# Altium project B101.PrjPcb
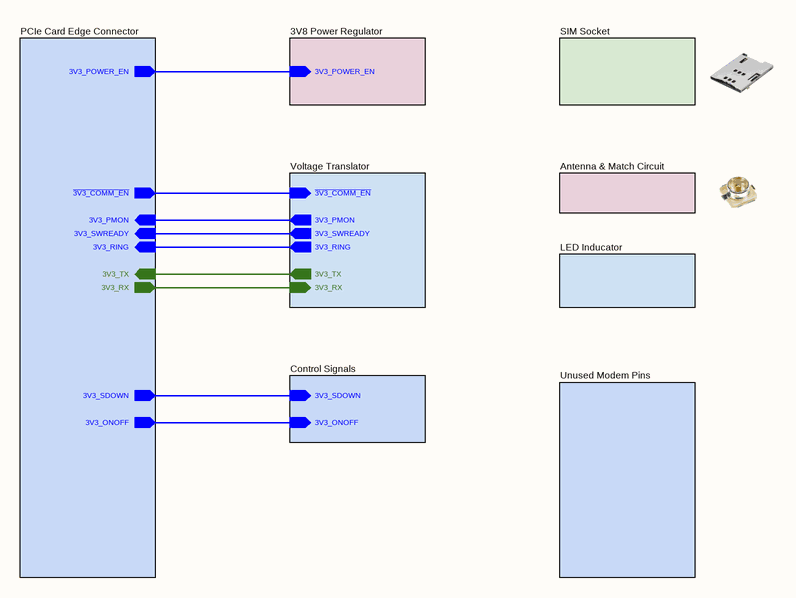
[diagram p0: GSM IoT Block Diagram.SchDoc]
Version_: 00.00.03; Revision_: CA; Product_ID_: B101; Product_Desc_: qSlot IoT 4G Modem; Organization_: Ovoo Electronics; Module_ID_: B101; Git_Repo_Address_: www.github.com/akkoyun/B101; Engineer_: Gunce Akkoyun; Customer_: Gunce Akkoyun; Copyright_: Copyright 2024 Mehmet Gunce Akkoyun (Commercial Secret); Address4_: Türkiye; Address3_: Selcuklu / Konya; Address2_: Silverstar Apt. 7/7; Address1_: Seker Mah. Ayyildiz Sok
9 sheets, 97 parts. Net scope: hierarchical (ports join the sheet entries above them; power ports are global).
Board file: B101.PcbDoc
Sheets:
  GSM IoT Block Diagram.SchDoc
    Voltage Translator = Voltage_Translator.SchDoc
    Antenna & Match Circuit = Antenna.SchDoc
    LED Inducator = Stat_LED_Driver.SchDoc
    SIM Socket = SIM_Socket.SchDoc
    3V8 Power Regulator = 3V8_Power_Regulator.SchDoc
    Unused Modem Pins = Unused_Modem_Pins.SchDoc
    PCIe Card Edge Connector = Edge_Connector.SchDoc
    Control Signals = Control_Signals.SchDoc

## Sheet GSM IoT Block Diagram.SchDoc: GSM IoT Block Diagram
size 292 x 193 mm; SheetNumber: 1; SheetTotal: 10

### Sub-sheets
3V8 Power Regulator = 3V8_Power_Regulator.SchDoc: 3V3_POWER_EN (in)
Antenna & Match Circuit = Antenna.SchDoc: no entries
Control Signals = Control_Signals.SchDoc: 3V3_SDOWN (in), 3V3_ONOFF (in)
LED Inducator = Stat_LED_Driver.SchDoc: no entries
PCIe Card Edge Connector = Edge_Connector.SchDoc: 3V3_POWER_EN (out), ~{3V3_COMM_EN} (out), 3V3_ONOFF (out), 3V3_SDOWN (out), 3V3_PMON (in), 3V3_SWREADY (in), 3V3_RING (in), 3V3_TX (in), 3V3_RX (out)
SIM Socket = SIM_Socket.SchDoc: no entries
Unused Modem Pins = Unused_Modem_Pins.SchDoc: no entries
Voltage Translator = Voltage_Translator.SchDoc: ~{3V3_COMM_EN} (in), 3V3_PMON (out), 3V3_SWREADY (out), 3V3_RING (out), 3V3_TX (out), 3V3_RX (in)

### Nets
~{3V3_COMM_EN}: sheet Voltage Translator/~{3V3_COMM_EN}, sheet PCIe Card Edge Connector/~{3V3_COMM_EN}
3V3_ONOFF: sheet PCIe Card Edge Connector/3V3_ONOFF, sheet Control Signals/3V3_ONOFF
3V3_PMON: sheet Voltage Translator/3V3_PMON, sheet PCIe Card Edge Connector/3V3_PMON
3V3_POWER_EN: sheet 3V8 Power Regulator/3V3_POWER_EN, sheet PCIe Card Edge Connector/3V3_POWER_EN
3V3_RING: sheet Voltage Translator/3V3_RING, sheet PCIe Card Edge Connector/3V3_RING
3V3_RX: sheet Voltage Translator/3V3_RX, sheet PCIe Card Edge Connector/3V3_RX
3V3_SDOWN: sheet PCIe Card Edge Connector/3V3_SDOWN, sheet Control Signals/3V3_SDOWN
3V3_SWREADY: sheet Voltage Translator/3V3_SWREADY, sheet PCIe Card Edge Connector/3V3_SWREADY
3V3_TX: sheet Voltage Translator/3V3_TX, sheet PCIe Card Edge Connector/3V3_TX

### Notes on the sheet
- © 2026 All rights reserved.
  This document may not, in whole or in part, be copied, photocopied, reproduced, translated or converted to any electronic or machine readable from without prior written permission of Mehmet Günce Akkoyun.
  Engineer contact : akkoyun@me.com
- Property of
- Engineer :
- Date :
- Size :
- A4
- Time :
- Project :
- Page :
- /
- Customer :
- Product ID :
- Module ID :
- Version :
- File :
- Revision :

## Sheet Voltage_Translator.SchDoc: Voltage Translator
size 420 x 297 mm; SheetNumber: 4; SheetTotal: 9
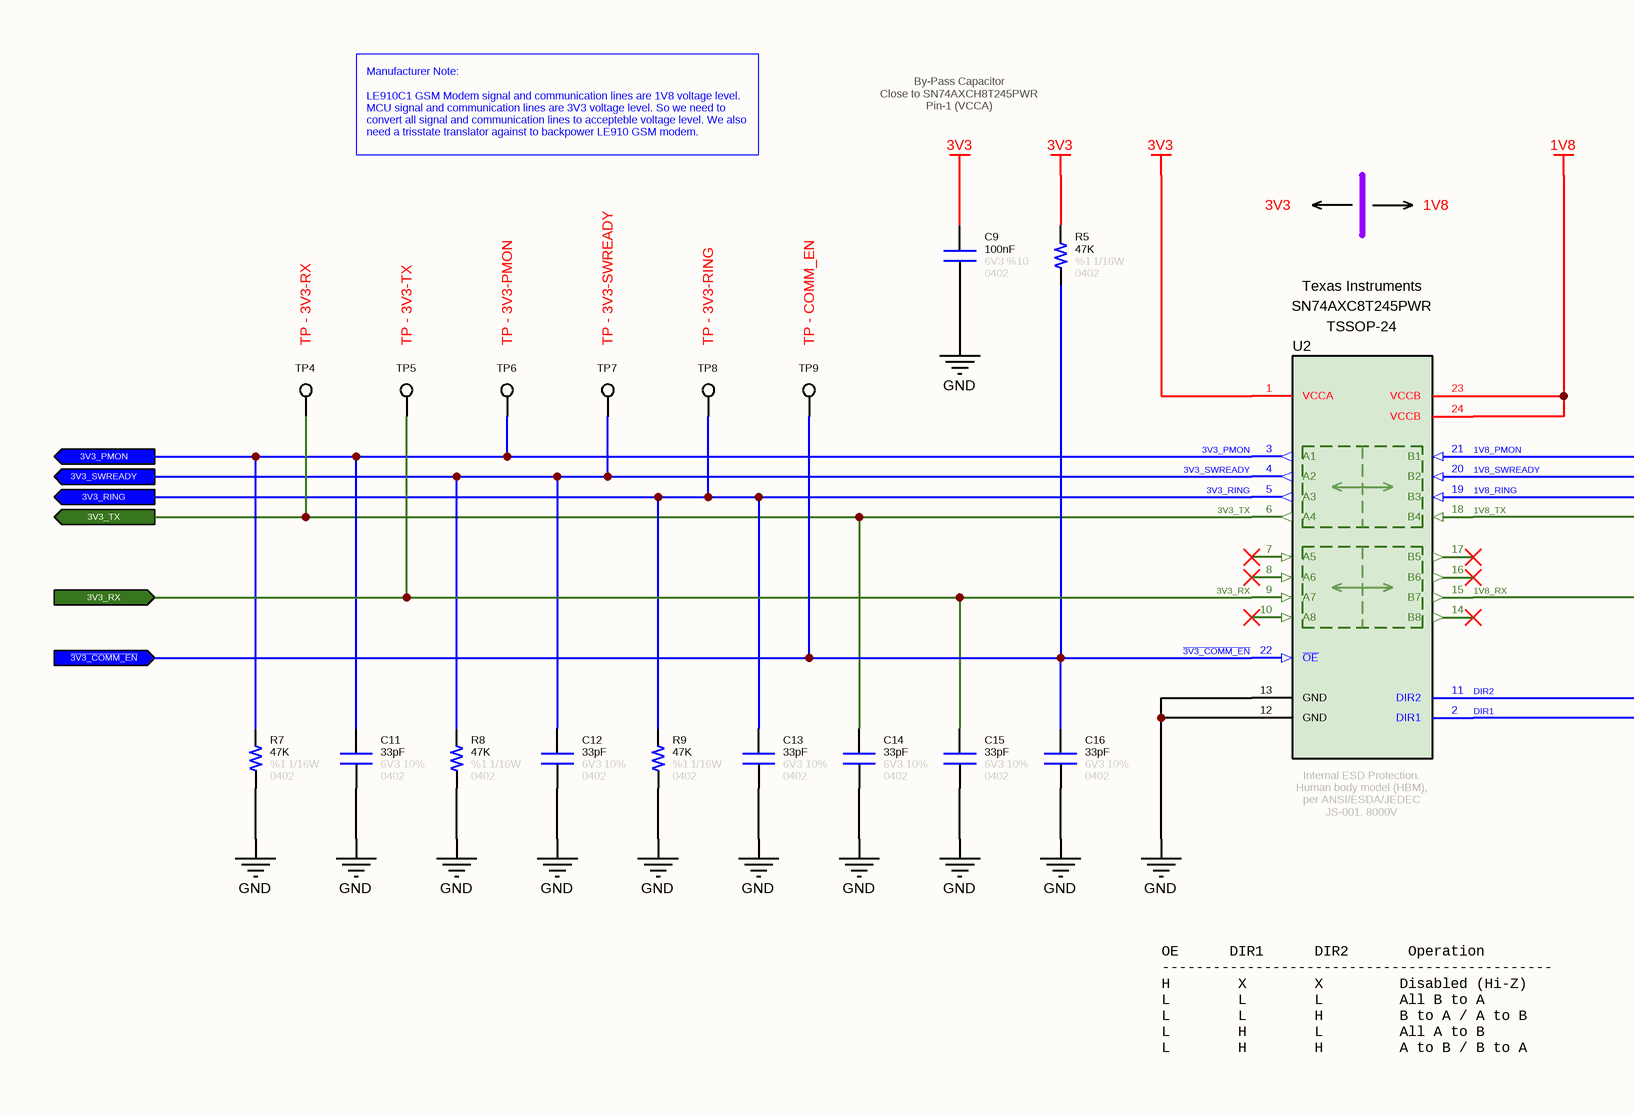
[diagram p1: Voltage_Translator.SchDoc, left]
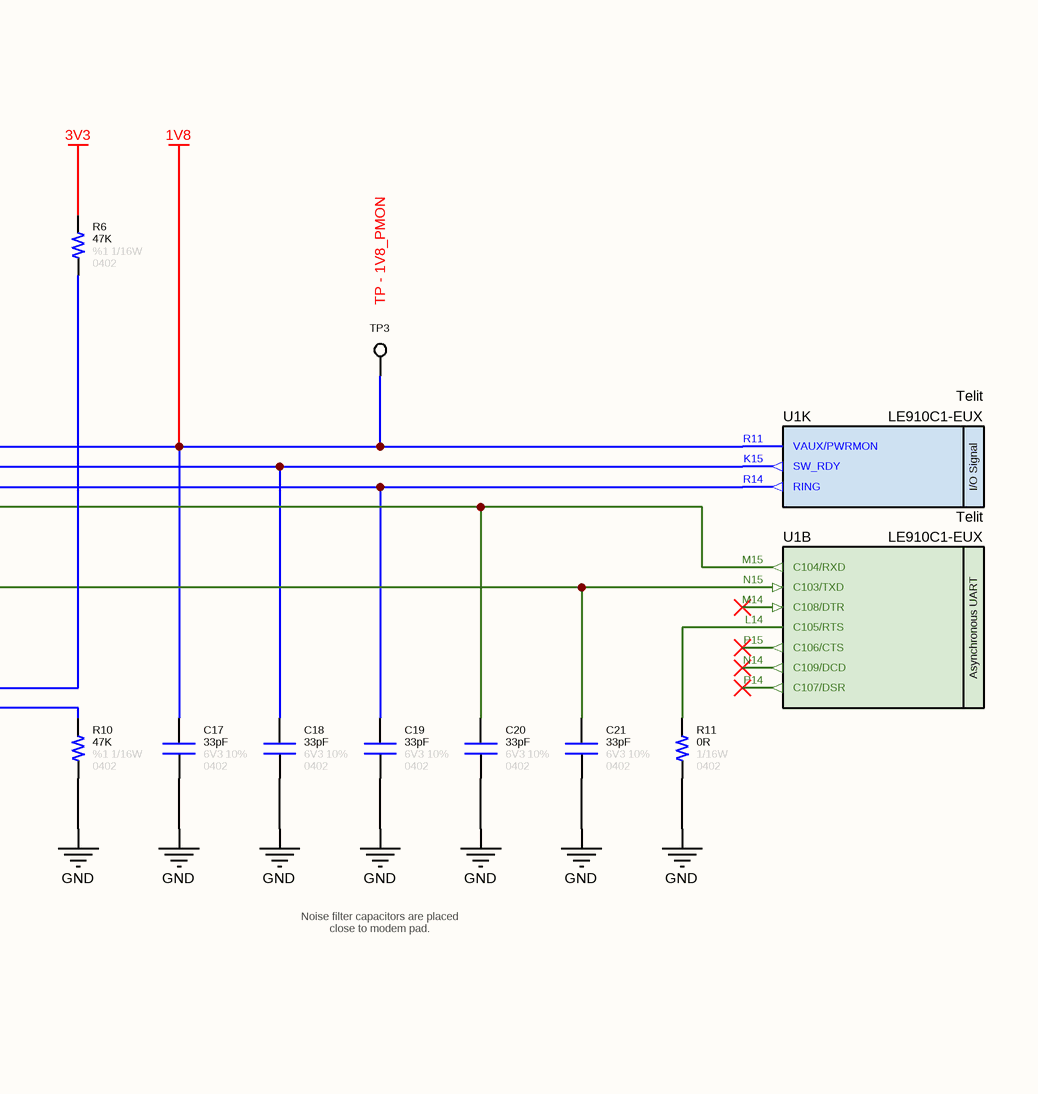
[diagram p2: Voltage_Translator.SchDoc, right]

### Parts
C9  value 100nF  Tolerance: %10  Voltage: 6V3  Case: 0402  [CAPACITOR_0402]  (hidden comment: Capacitor - 100nF [0402] (Ceramic))
C11  value 33pF  Tolerance: 10%  Case: 0402  Voltage: 6V3  [CAPACITOR_0402]  (hidden comment: Capacitor - 33pF [0402] (Ceramic))
C12  value 33pF  Tolerance: 10%  Case: 0402  Voltage: 6V3  [CAPACITOR_0402]  (hidden comment: Capacitor - 33pF [0402] (Ceramic))
C13  value 33pF  Tolerance: 10%  Case: 0402  Voltage: 6V3  [CAPACITOR_0402]  (hidden comment: Capacitor - 33pF [0402] (Ceramic))
C14  value 33pF  Tolerance: 10%  Case: 0402  Voltage: 6V3  [CAPACITOR_0402]  (hidden comment: Capacitor - 33pF [0402] (Ceramic))
C15  value 33pF  Tolerance: 10%  Case: 0402  Voltage: 6V3  [CAPACITOR_0402]  (hidden comment: Capacitor - 33pF [0402] (Ceramic))
C16  value 33pF  Tolerance: 10%  Case: 0402  Voltage: 6V3  [CAPACITOR_0402]  (hidden comment: Capacitor - 33pF [0402] (Ceramic))
C17  value 33pF  Tolerance: 10%  Case: 0402  Voltage: 6V3  [CAPACITOR_0402]  (hidden comment: Capacitor - 33pF [0402] (Ceramic))
C18  value 33pF  Tolerance: 10%  Case: 0402  Voltage: 6V3  [CAPACITOR_0402]  (hidden comment: Capacitor - 33pF [0402] (Ceramic))
C19  value 33pF  Tolerance: 10%  Case: 0402  Voltage: 6V3  [CAPACITOR_0402]  (hidden comment: Capacitor - 33pF [0402] (Ceramic))
C20  value 33pF  Tolerance: 10%  Case: 0402  Voltage: 6V3  [CAPACITOR_0402]  (hidden comment: Capacitor - 33pF [0402] (Ceramic))
C21  value 33pF  Tolerance: 10%  Case: 0402  Voltage: 6V3  [CAPACITOR_0402]  (hidden comment: Capacitor - 33pF [0402] (Ceramic))
R5  value 47K  Tolerance: %1  Case: 0402  Power: 1/16W  [RESISTOR_0402]  (hidden comment: 47K - 0402 - %1 - 1/16W)
R6  value 47K  Tolerance: %1  Case: 0402  Power: 1/16W  [RESISTOR_0402]  (hidden comment: 47K - 0402 - %1 - 1/16W)
R7  value 47K  Tolerance: %1  Case: 0402  Power: 1/16W  [RESISTOR_0402]  (hidden comment: 47K - 0402 - %1 - 1/16W)
R8  value 47K  Tolerance: %1  Case: 0402  Power: 1/16W  [RESISTOR_0402]  (hidden comment: 47K - 0402 - %1 - 1/16W)
R9  value 47K  Tolerance: %1  Case: 0402  Power: 1/16W  [RESISTOR_0402]  (hidden comment: 47K - 0402 - %1 - 1/16W)
R10  value 47K  Tolerance: %1  Case: 0402  Power: 1/16W  [RESISTOR_0402]  (hidden comment: 47K - 0402 - %1 - 1/16W)
R11  value 0R  Case: 0402  Power: 1/16W  [RESISTOR_0402]  (hidden comment: 0R - 0402 - %1 - 1/16W)
TP3  TP - 1V8_PMON  [TP]  (no BOM)
TP4  TP - 3V3-RX  [TP]  (no BOM)
TP5  TP - 3V3-TX  [TP]  (no BOM)
TP6  TP - 3V3-PMON  [TP]  (no BOM)
TP7  TP - 3V3-SWREADY  [TP]  (no BOM)
TP8  TP - 3V3-RING  [TP]  (no BOM)
TP9  TP - COMM_EN  [TP]  (no BOM)
U1  Manufacturer Part Number: LE910C1-EUX  Manufacturer Name: Telit  [LE910 GSM Modem]  (hidden comment: LE910C1-EUX LTE GSM Module)  (parts B,K of 19)
U2  Manufacturer Name: Texas Instruments  [TSSOP-24]  (hidden comment: SN74AXC8T245PWR)

### Ports
3V3_PMON (out), 3V3_RING (out), 3V3_RX (in), 3V3_SWREADY (out), 3V3_TX (out), ~{3V3_COMM_EN} (in)

### Nets
1V8_PMON: C17.2 TP3.1 U1.R11(VAUX/PWRMON) U2.21(B1) U2.23(VCCB) U2.24(VCCB)  [also labelled 1V8]
3V3: C9.2 R5.2 R6.2 U2.1(VCCA)
GND: C9.1 C11.1 C12.1 C13.1 C14.1 C15.1 C16.1 C17.1 C18.1 C19.1 C20.1 C21.1 R7.1 R8.1 R9.1 R10.1 R11.1 U2.12(GND) U2.13(GND)
1V8_RING: C19.2 U1.R14(RING) U2.19(B3)
1V8_RX: C21.2 U1.N15(C103/TXD) U2.15(B7)
1V8_SWREADY: C18.2 U1.K15(SW_RDY) U2.20(B2)
1V8_TX: C20.2 U1.M15(C104/RXD) U2.18(B4)
~{3V3_COMM_EN}: C16.2 R5.1 TP9.1 U2.22(~{OE}) ; port ~{3V3_COMM_EN}
3V3_PMON: C11.2 R7.2 TP6.1 U2.3(A1) ; port 3V3_PMON
3V3_RING: C13.2 R9.2 TP8.1 U2.5(A3) ; port 3V3_RING
3V3_RX: C15.2 TP5.1 U2.9(A7) ; port 3V3_RX
3V3_SWREADY: C12.2 R8.2 TP7.1 U2.4(A2) ; port 3V3_SWREADY
3V3_TX: C14.2 TP4.1 U2.6(A4) ; port 3V3_TX
DIR1: R10.2 U2.2(DIR1)
DIR2: R6.1 U2.11(DIR2)
NetR11_2: R11.2 U1.L14(C105/RTS)

Not connected (* = marked no-connect by the designer): U1 M14(C108/DTR)* N14(C109/DCD)* P14(C107/DSR)* P15(C106/CTS)*; U2 7(A5)* 8(A6)* 10(A8)* 14(B8)* 16(B6)* 17(B5)*

### Notes on the sheet
- Manufacturer Note:
  LE910C1 GSM Modem signal and communication lines are 1V8 voltage level.  MCU signal and communication lines are 3V3 voltage level. So we need to convert all signal and communication lines to accepteble voltage level. We also need a trisstate translator against to backpower LE910 GSM modem.
- By-Pass Capacitor
  Close to SN74AXCH8T245PWR
  Pin-1 (VCCA)
- 3V3
- 1V8
- Noise filter capacitors are placed close to modem pad.
- OE      DIR1      DIR2       Operation
  ----------------------------------------------
  H        X        X         Disabled (Hi-Z)
  L        L        L         All B to A
  L        L        H         B to A / A to B
  L        H        L         All A to B
  L        H        H         A to B / B to A
- © 2026 All rights reserved.
  This document may not, in whole or in part, be copied, photocopied, reproduced, translated or converted to any electronic or machine readable from without prior written permission of Mehmet Günce Akkoyun.
  Engineer contact : akkoyun@me.com
- Property of
- Engineer :
- Date :
- Size :
- A4
- Time :
- Project :
- Page :
- /
- Customer :
- Product ID :
- Module ID :
- Version :
- File :
- Revision :
- (in symbol IC - LE910C1-EUX, part B) Asynchronous UART
- (in symbol IC - LE910C1-EUX, part K) I/O Signal
- (in symbol IC - SN74AXC8T245PWR) Internal ESD Protection. / Human body model (HBM), per ANSI/ESDA/JEDEC JS-001. 8000V

### Library data of the parts
C9 = Capacitor - 100nF [0402-6V3]: Capacitor - 100nF [0402-6V3] (Ceramic); Manufacturer Name: AVX; Manufacturer Part Number: 04026D104KAT4A; ComponentLink1Description: Mouser; ComponentLink1URL: https://www.mouser.com.tr/ProductDetail/AVX/04026D104KAT4A?qs=sGAEpiMZZMs0AnBnWHyRQPg4iYkCw7IMED%2F4kpqgf7w%3D; ComponentLink2Description: DataSheet; ComponentLink2URL: https://www.mouser.com.tr/datasheet/2/40/cx5r-776519.pdf
C11-C21 = Capacitor - 33pF [0402-6V3]: Manufacturer Name: Kemet; Manufacturer Part Number: C0402C330J9RACAUTO; ComponentLink1Description: DataSheet; ComponentLink1URL: https://api.kemet.com/component-edge/download/datasheet/C0402C330J9RACAUTO.pdf; ComponentLink2Description: Mouser; ComponentLink2URL: https://www.mouser.com/Search/Refine.aspx?Keyword=80-C0402C330J9RAUTO
R5-R10 = Resistor - 47K [0402]: Thick Film Resistors - SMD 1/16 W 47 KOhm 1%; Manufacturer Name: Vishay; Manufacturer Part Number: CRCW040247K0FKED; ComponentLink1Description: DataSheet; ComponentLink1URL: https://www.mouser.com.tr/datasheet/2/427/dcrcwe3-1762152.pdf; ComponentLink2Description: Mouser; ComponentLink2URL: https://www.mouser.com.tr/ProductDetail/Vishay-Dale/CRCW040247K0FKED?qs=sGAEpiMZZMu61qfTUdNhG2DpbjADlD3GL%252B3h1elTxqU%3D
R11 = Resistor - 0R [0402]: Thick Film Resistors - SMD 1/16 W 0 Ohm; Manufacturer Name: Vishay; Manufacturer Part Number: CRCW04020000Z0ED; ComponentLink1Description: DataSheet; ComponentLink1URL: https://www.mouser.com.tr/datasheet/2/427/dcrcwe3-1762152.pdf; ComponentLink2Description: Mouser; ComponentLink2URL: https://www.mouser.com.tr/ProductDetail/Vishay-Dale/CRCW04020000Z0ED?qs=sGAEpiMZZMu61qfTUdNhG2DpbjADlD3GG34cJb50zyg%3D
TP3-TP9 = PCB - Test Point: Test Point
U1 = IC - LE910C1-EUX: Telit LE910C1-EUX LTE/2G GSM Module; Case: BGA
U2 = IC - SN74AXC8T245PWR: Translation - Voltage Levels 8-Bit Dual-Supply Bus Transceiver 24-TSSOP -40 to 125; Number of Channels: 8 Channel; Logic Family: AXC; Data Rate: 380Mbps; Channel Type: Bidirectional; Supply Voltage - Min: 0V65; Supply Voltage - Max: 3V6; Output Type: Tri-State, Non-Inverted; Operating Supply Current: 60 uA; Propagation Delay Time: 4 ns; ROHS: Yes; Minimum Operating Temperature: - 40 C; Product Type: Translation - Voltage Levels; Maximum Operating Temperature: + 125 C; Manufacturer Part Number: SN74AXC8T245PWR; Case: TSSOP-24

## Sheet Antenna.SchDoc: GSM Antenna & Match Circuit
size 292 x 193 mm; SheetNumber: 8; SheetTotal: 9
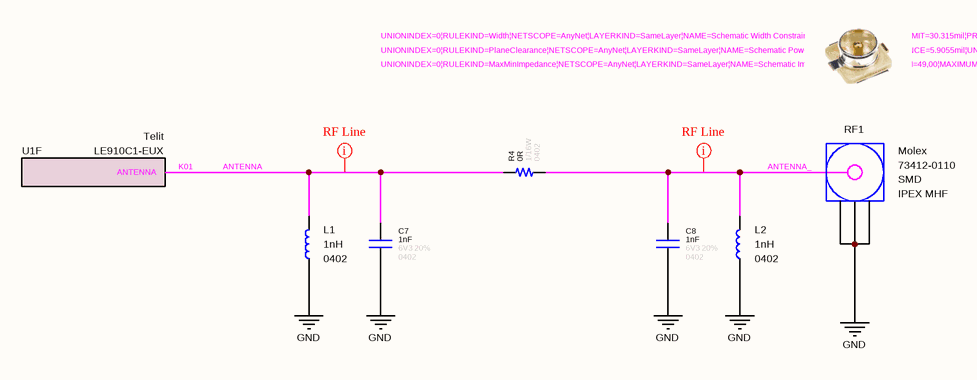
[diagram p3: Antenna.SchDoc]

### Parts
C7  value 1nF  Tolerance: 20%  Case: 0402  Voltage: 6V3  [CAPACITOR_0402]  (hidden comment: Capacitor - 1nF [0402] (Ceramic))
C8  value 1nF  Tolerance: 20%  Case: 0402  Voltage: 6V3  [CAPACITOR_0402]  (hidden comment: Capacitor - 1nF [0402] (Ceramic))
L1  value 1nH  Case: 0402  [INDUCTOR_0402]  (hidden comment: Fixed Inductor)
L2  value 1nH  Case: 0402  [INDUCTOR_0402]  (hidden comment: Fixed Inductor)
R4  value 0R  Case: 0402  Power: 1/16W  [RESISTOR_0402]  (hidden comment: 0R - 0402 - %1 - 1/16W)
RF1  Connector Type: IPEX MHF  Case: SMD  Manufacturer Name: Molex  [Connector_IPEX]  (hidden comment: 73412-0110)
U1  Manufacturer Part Number: LE910C1-EUX  Manufacturer Name: Telit  [LE910 GSM Modem]  (hidden comment: LE910C1-EUX LTE GSM Module)  (part F of 19)

### Nets
GND: C7.1 C8.1 L1.1 L2.1 RF1.2(GND) RF1.3(GND) RF1.4(GND)
ANTENNA: C7.2 L1.2 R4.2 U1.K01(ANTENNA)
ANTENNA_: C8.2 L2.2 R4.1 RF1.1(Signal)

### Layout directives
rule Impedance Constraint [Min = 49.00    Max = 50.00    ]; rule Power Plane Clearance [Clearance = 5.906mil]; rule Width Constraint [Pref Width = 0.77mm    Min Width = 0.77mm    Max Width = 0.77mm]: ANTENNA, ANTENNA_

### Notes on the sheet
- © 2026 All rights reserved.
  This document may not, in whole or in part, be copied, photocopied, reproduced, translated or converted to any electronic or machine readable from without prior written permission of Mehmet Günce Akkoyun.
  Engineer contact : akkoyun@me.com
- Property of
- Engineer :
- Date :
- Size :
- A4
- Time :
- Project :
- Page :
- /
- Customer :
- Product ID :
- Module ID :
- Version :
- File :
- Revision :

### Library data of the parts
C7 C8 = Capacitor - 1nF [0402-6V3]: Manufacturer Name: AVX; Manufacturer Part Number: 04026C102MAT2A; ComponentLink1Description: DataSheet; ComponentLink1URL: https://www.mouser.com.tr/datasheet/2/40/X7RDielectric-777024.pdf
L1 L2 = Inductor - 1nH [0402]: Manufacturer Name: Murata Electronics; Manufacturer Part Number: LQG15HN1N0S02D; Tolerance: 0.3 nH; Height: 0.35mm; ComponentLink1Description: DataSheet; ComponentLink1URL: https://www.mouser.com.tr/datasheet/2/281/JELF243B-0009-1699631.pdf
R4 = Resistor - 0R [0402]: as R11 on sheet Voltage_Translator; ComponentLink1Description: DataSheet; ComponentLink1URL: https://www.mouser.com.tr/datasheet/2/427/dcrcwe3-1762152.pdf; ComponentLink2Description: Mouser; ComponentLink2URL: https://www.mouser.com.tr/ProductDetail/Vishay-Dale/CRCW04020000Z0ED?qs=sGAEpiMZZMu61qfTUdNhG2DpbjADlD3GG34cJb50zyg%3D
RF1 = Connector - IPEX MHF: MOLEX   73412-0110   RF COAXIAL, MICROCOAXIAL, JACK, 50OHM; ROHS: Yes; Product Type: RF Connectors; Impedance: 50 Ohm; System: Connector; Manufacturer Part Number: 73412-0110
U1 = IC - LE910C1-EUX: Telit LE910C1-EUX LTE/2G GSM Module; Case: BGA

## Sheet Stat_LED_Driver.SchDoc: Modem LED Driver
size 292 x 193 mm; SheetNumber: 9; SheetTotal: 9
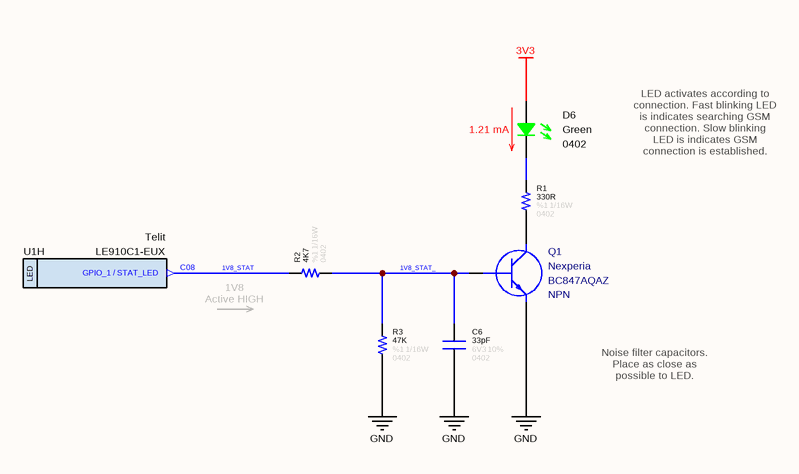
[diagram p4: Stat_LED_Driver.SchDoc]

### Parts
C6  value 33pF  Tolerance: 10%  Case: 0402  Voltage: 6V3  [CAPACITOR_0402]  (hidden comment: Capacitor - 33pF [0402] (Ceramic))
D6  Case: 0402  Color: Green  [LED_0402]  (hidden comment: SMD LED (Green))
Q1  Manufacturer Name: Nexperia  Polarity: NPN  [SOT1215]  (hidden comment: BC847AQAZ)
R1  value 330R  Case: 0402  Tolerance: %1  Power: 1/16W  [RESISTOR_0402]  (hidden comment: 330R - 0402 - %1 - 1/16W)
R2  value 4K7  Tolerance: %1  Case: 0402  Power: 1/16W  [RESISTOR_0402]  (hidden comment: 4K7 - 0402 - %1 - 1/16W)
R3  value 47K  Tolerance: %1  Case: 0402  Power: 1/16W  [RESISTOR_0402]  (hidden comment: 47K - 0402 - %1 - 1/16W)
U1  Manufacturer Part Number: LE910C1-EUX  Manufacturer Name: Telit  [LE910 GSM Modem]  (hidden comment: LE910C1-EUX LTE GSM Module)  (part H of 19)

### Nets
3V3: D6.2
GND: C6.1 Q1.2(E) R3.1
1V8_STAT: R2.2 U1.C08(GPIO_1_/_STAT_LED)
1V8_STAT_: C6.2 Q1.1(B) R2.1 R3.2
NetD6_1: D6.1 R1.2
NetQ1_3: Q1.3(C) R1.1

### Notes on the sheet
- (near D6) 1.21 mA
- LED activates according to connection. Fast blinking LED is indicates searching GSM connection. Slow blinking LED is indicates GSM connection is established.
- 1V8
  Active HIGH
- Noise filter capacitors. Place as close as possible to LED.
- © 2026 All rights reserved.
  This document may not, in whole or in part, be copied, photocopied, reproduced, translated or converted to any electronic or machine readable from without prior written permission of Mehmet Günce Akkoyun.
  Engineer contact : akkoyun@me.com
- Property of
- Engineer :
- Date :
- Size :
- A4
- Time :
- Project :
- Page :
- /
- Customer :
- Product ID :
- Module ID :
- Version :
- File :
- Revision :
- (in symbol IC - LE910C1-EUX, part H) LED

### Library data of the parts
C6 = Capacitor - 33pF [0402-6V3]: as C11 on sheet Voltage_Translator; ComponentLink1Description: DataSheet; ComponentLink1URL: https://api.kemet.com/component-edge/download/datasheet/C0402C330J9RACAUTO.pdf; ComponentLink2Description: Mouser; ComponentLink2URL: https://www.mouser.com/Search/Refine.aspx?Keyword=80-C0402C330J9RAUTO
D6 = Diode - LED (0402-Green): Standard LEDs - SMD MINI-MOLD ULTRA COMPACT GREEN; Manufacturer Name: ROHM Semiconductor; Manufacturer Part Number: SML-P12MTT86R; ROHS: Yes; ComponentLink1Description: DataSheet; ComponentLink1URL: https://www.mouser.com.tr/datasheet/2/348/sml-p1-e-1139198.pdf; ComponentLink2Description: Mouser; ComponentLink2URL: https://www.mouser.com.tr/ProductDetail/ROHM-Semiconductor/SML-P12U2TT86R?qs=sGAEpiMZZMseGfSY3csMkRIBDsfU3UCXJTULB5gem9Ta%252Bp%252BvZ709fg%3D%3D
Q1 = Transistor - BC847: Bipolar NPN Transistors; Case: DFN-1010D-3; Manufacturer Part Number: BC847AQAZ
R1 = Resistor - 330R [0402]: Thick Film Resistors - SMD 1/16 W 330 Ohm 1%; Manufacturer Name: Vishay; Manufacturer Part Number: CRCW0402330RFKED; ComponentLink1Description: DataSheet; ComponentLink1URL: https://www.mouser.com.tr/datasheet/2/427/dcrcwe3-1762152.pdf; ComponentLink2Description: Mouser; ComponentLink2URL: https://www.mouser.com.tr/ProductDetail/Vishay-Dale/CRCW0402330RFKED?qs=sGAEpiMZZMu61qfTUdNhG2DpbjADlD3GGS6SwBlLi5Q%3D
R2 = Resistor - 4K7 [0402]: Thick Film Resistors - SMD 1/16 W 4.7 KOhm 1%; Manufacturer Name: Vishay; Manufacturer Part Number: CRCW04024K70FKED; ComponentLink1Description: DataSheet; ComponentLink1URL: https://www.mouser.com.tr/datasheet/2/427/dcrcwe3-1762152.pdf; ComponentLink2Description: Mouser; ComponentLink2URL: https://www.mouser.com.tr/ProductDetail/Vishay-Dale/CRCW04024K70FKED?qs=sGAEpiMZZMu61qfTUdNhG7nHf%2F6MTUn3HadIdDQu24Q%3D
R3 = Resistor - 47K [0402]: as R5 on sheet Voltage_Translator; ComponentLink1Description: DataSheet; ComponentLink1URL: https://www.mouser.com.tr/datasheet/2/427/dcrcwe3-1762152.pdf; ComponentLink2Description: Mouser; ComponentLink2URL: https://www.mouser.com.tr/ProductDetail/Vishay-Dale/CRCW040247K0FKED?qs=sGAEpiMZZMu61qfTUdNhG2DpbjADlD3GL%252B3h1elTxqU%3D
U1 = IC - LE910C1-EUX: Telit LE910C1-EUX LTE/2G GSM Module; Case: BGA

## Sheet SIM_Socket.SchDoc: SIM Tray
size 292 x 193 mm; SheetNumber: 7; SheetTotal: 9
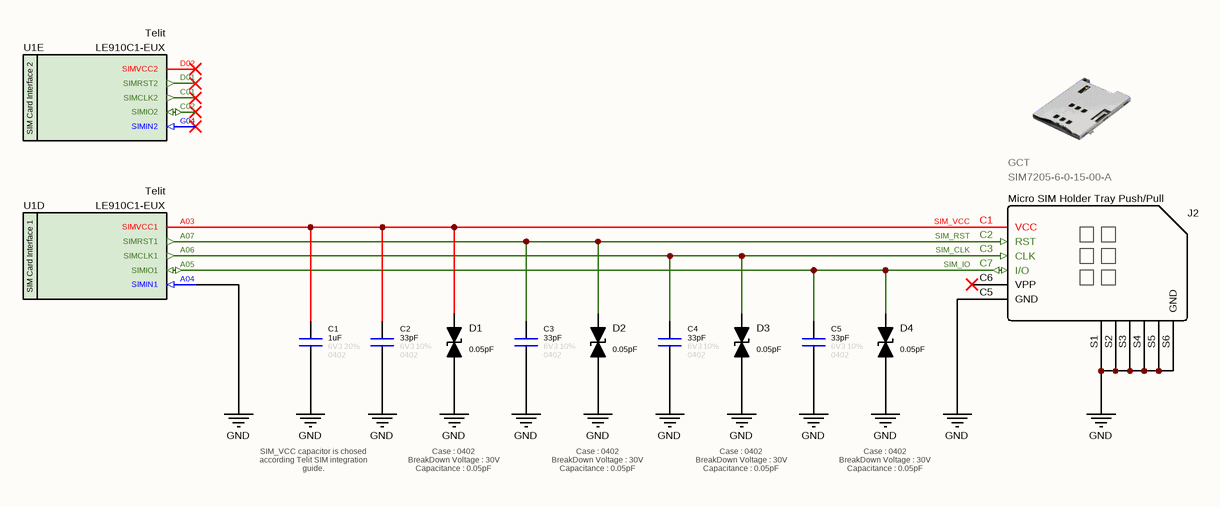
[diagram p5: SIM_Socket.SchDoc]

### Parts
C1  value 1uF  Tolerance: 20%  Case: 0402  Voltage: 6V3  [CAPACITOR_0402]  (hidden comment: Capacitor - 1uF [0402] (Ceramic))
C2  value 33pF  Tolerance: 10%  Case: 0402  Voltage: 6V3  [CAPACITOR_0402]  (hidden comment: Capacitor - 33pF [0402] (Ceramic))
C3  value 33pF  Tolerance: 10%  Case: 0402  Voltage: 6V3  [CAPACITOR_0402]  (hidden comment: Capacitor - 33pF [0402] (Ceramic))
C4  value 33pF  Tolerance: 10%  Case: 0402  Voltage: 6V3  [CAPACITOR_0402]  (hidden comment: Capacitor - 33pF [0402] (Ceramic))
C5  value 33pF  Tolerance: 10%  Case: 0402  Voltage: 6V3  [CAPACITOR_0402]  (hidden comment: Capacitor - 33pF [0402] (Ceramic))
D1  Capacitance: 0.05pF  [INDUCTOR_0402]  (hidden comment: 0402ESDA-MLP1)
D2  Capacitance: 0.05pF  [INDUCTOR_0402]  (hidden comment: 0402ESDA-MLP1)
D3  Capacitance: 0.05pF  [INDUCTOR_0402]  (hidden comment: 0402ESDA-MLP1)
D4  Capacitance: 0.05pF  [INDUCTOR_0402]  (hidden comment: 0402ESDA-MLP1)
J2  Card Type: Micro SIM Holder Tray Push/Pull  Manufacturer Name: GCT  [CONNECTOR - Micro SIM Card]  (hidden comment: SIM7205-6-0-15-00-A)
U1  Manufacturer Part Number: LE910C1-EUX  Manufacturer Name: Telit  [LE910 GSM Modem]  (hidden comment: LE910C1-EUX LTE GSM Module)  (parts D,E of 19)

### Nets
GND: C1.1 C2.1 C3.1 C4.1 C5.1 D1.2(GND) D2.2(GND) D3.2(GND) D4.2(GND) J2.C5(GND) J2.S1(GND) J2.S2(GND) J2.S3(GND) J2.S4(GND) J2.S5(GND) J2.S6(GND) U1.A04(SIMIN1)
SIM_CLK: C4.2 D3.1(I/O) J2.C3(CLK) U1.A06(SIMCLK1)
SIM_IO: C5.2 D4.1(I/O) J2.C7(I/O) U1.A05(SIMIO1)
SIM_RST: C3.2 D2.1(I/O) J2.C2(RST) U1.A07(SIMRST1)
SIM_VCC: C1.2 C2.2 D1.1(I/O) J2.C1(VCC) U1.A03(SIMVCC1)

Not connected (* = marked no-connect by the designer): J2 C6(VPP)*; U1 C01(SIMCLK2)* C02(SIMIO2)* D01(SIMRST2)* D02(SIMVCC2)* G04(SIMIN2)*

### Notes on the sheet
- SIM_VCC capacitor is chosed according Telit SIM integration guide.
- Case : 0402
  BreakDown Voltage : 30V
  Capacitance : 0.05pF
- © 2026 All rights reserved.
  This document may not, in whole or in part, be copied, photocopied, reproduced, translated or converted to any electronic or machine readable from without prior written permission of Mehmet Günce Akkoyun.
  Engineer contact : akkoyun@me.com
- Property of
- Engineer :
- Date :
- Size :
- A4
- Time :
- Project :
- Page :
- /
- Customer :
- Product ID :
- Module ID :
- Version :
- File :
- Revision :
- (in symbol IC - LE910C1-EUX, part D) SIM Card Interface 1
- (in symbol IC - LE910C1-EUX, part E) SIM Card Interface 2

### Library data of the parts
C1 = Capacitor - 1uF [0402-6V3]: Multilayer Ceramic Capacitors - SMD - 6.3V 1uF X5R 0402 20%; Manufacturer Part Number: GRM153R60J105ME95D; Manufacturer Name: Murata
C2-C5 = Capacitor - 33pF [0402-6V3]: as C11 on sheet Voltage_Translator; ComponentLink1Description: DataSheet; ComponentLink1URL: https://api.kemet.com/component-edge/download/datasheet/C0402C330J9RACAUTO.pdf; ComponentLink2Description: Mouser; ComponentLink2URL: https://www.mouser.com/Search/Refine.aspx?Keyword=80-C0402C330J9RAUTO
D1-D4 = Diode - 0402ESDA-MLP1 (ESD): ESD Protection Diodes / TVS Diodes PolySurg 0402 35V .05pF; Manufacturer Name: Eaton; Breakdown Voltage: 30V; Case: 0402; Manufacturer Part Number: 0402ESDA-MLP1
J2 = Connector - Sim Holder (Micro SIM): Memory Card Connectors Micro SIM Push-Pull, 6P, SMT, 1.48mm Profile, No Peg, Without switch, T&R; Manufacturer Part Number: SIM7205-6-0-15-00-A
U1 = IC - LE910C1-EUX: Telit LE910C1-EUX LTE/2G GSM Module; Case: BGA

## Sheet 3V8_Power_Regulator.SchDoc: 3V8 Power Regulator
size 420 x 297 mm; SheetNumber: 3; SheetTotal: 9
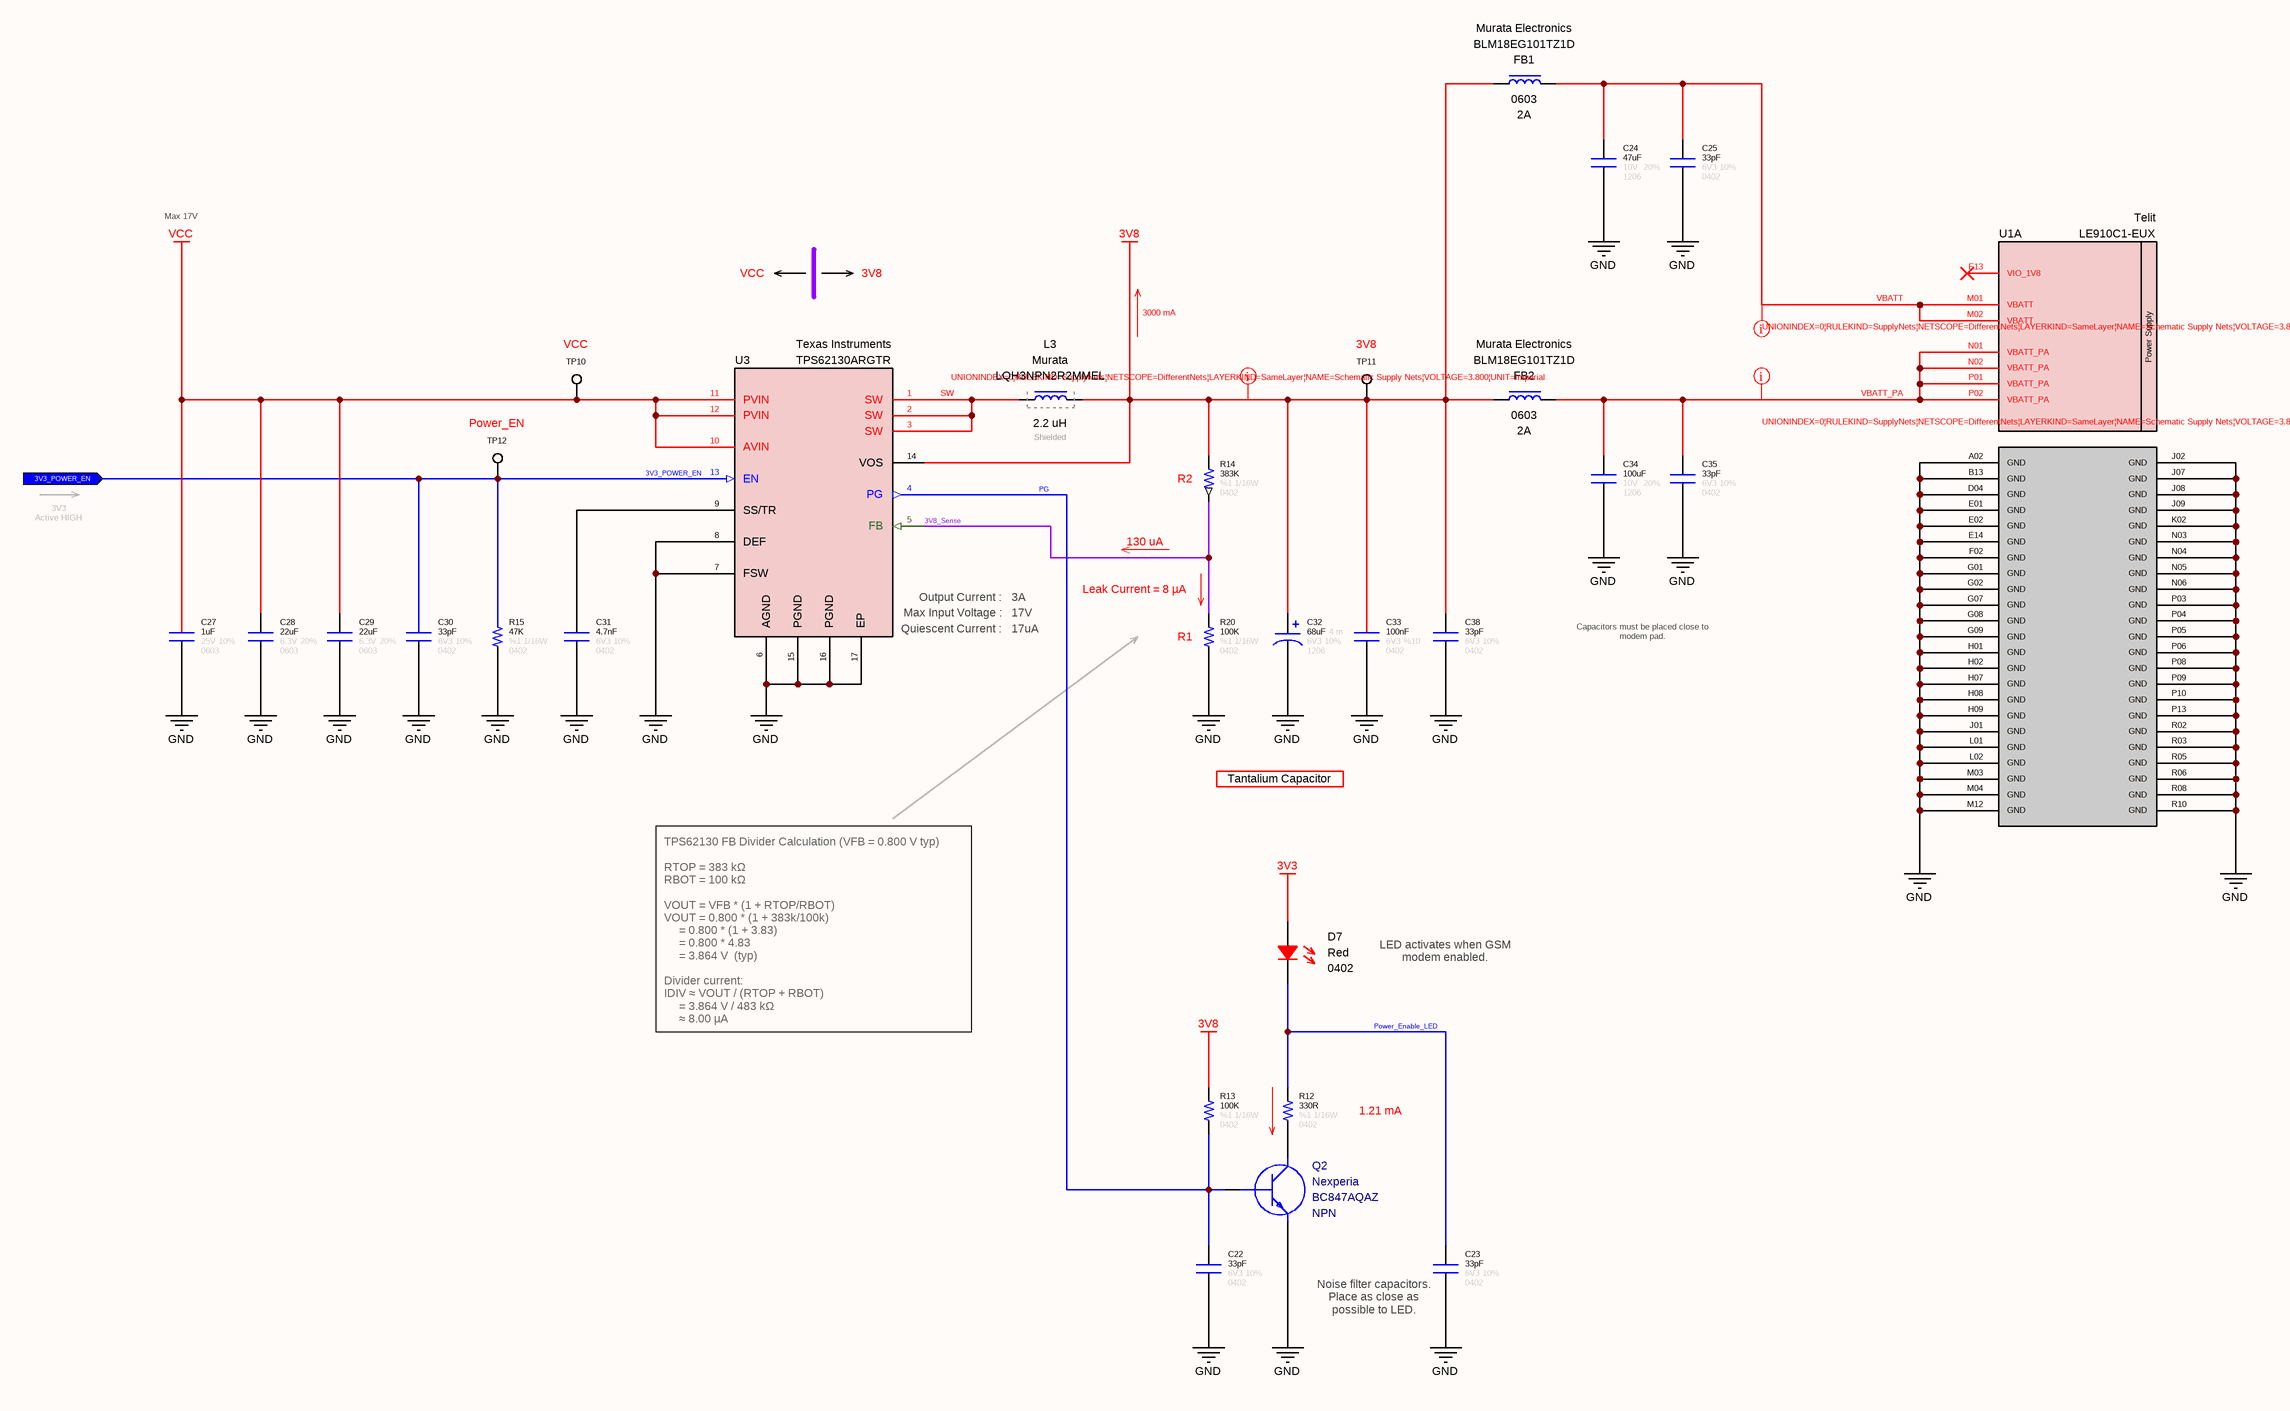
[diagram p6: 3V8_Power_Regulator.SchDoc]

### Parts
C22  value 33pF  Tolerance: 10%  Case: 0402  Voltage: 6V3  [CAPACITOR_0402]  (hidden comment: Capacitor - 33pF [0402] (Ceramic))
C23  value 33pF  Tolerance: 10%  Case: 0402  Voltage: 6V3  [CAPACITOR_0402]  (hidden comment: Capacitor - 33pF [0402] (Ceramic))
C24  value 47uF  Tolerance: 20%  Case: 1206  Voltage: 10V  [CAPACITOR_1206]  (hidden comment: Capacitor - 47uF [1206] (Ceramic))
C25  value 33pF  Tolerance: 10%  Case: 0402  Voltage: 6V3  [CAPACITOR_0402]  (hidden comment: Capacitor - 33pF [0402] (Ceramic))
C27  value 1uF  Tolerance: 10%  Case: 0603  Voltage: 25V  [CAPACITOR_0402]  (hidden comment: Capacitor - 1uF [0603] (Ceramic))
C28  value 22uF  Tolerance: 20%  Case: 0603  Voltage: 6.3V  [CAPACITOR_0603]  (hidden comment: Capacitor - 22uF [0603] (MLCC))
C29  value 22uF  Tolerance: 20%  Case: 0603  Voltage: 6.3V  [CAPACITOR_0603]  (hidden comment: Capacitor - 22uF [0603] (MLCC))
C30  value 33pF  Tolerance: 10%  Case: 0402  Voltage: 6V3  [CAPACITOR_0402]  (hidden comment: Capacitor - 33pF [0402] (Ceramic))
C31  value 4.7nF  Tolerance: 10%  Case: 0402  Voltage: 6V3  [CAPACITOR_0402]  (hidden comment: Capacitor - 4.7nF [0402] (MLCC))
C32  value 68uF  ESR: 4 m  Tolerance: 10%  Case: 1206  Voltage: 6V3  [CAPACITOR_1206 (Kemet)]  (hidden comment: Capacitor - 68uF [1206] (Tantalum))
C33  value 100nF  Tolerance: %10  Voltage: 6V3  Case: 0402  [CAPACITOR_0402]  (hidden comment: Capacitor - 100nF [0402] (Ceramic))
C34  value 100uF  Tolerance: 20%  Case: 1206  Voltage: 10V  [CAPACITOR_1206]  (hidden comment: Capacitor - 100uF [1206] (Ceramic))
C35  value 33pF  Tolerance: 10%  Case: 0402  Voltage: 6V3  [CAPACITOR_0402]  (hidden comment: Capacitor - 33pF [0402] (Ceramic))
C38  value 33pF  Tolerance: 10%  Case: 0402  Voltage: 6V3  [CAPACITOR_0402]  (hidden comment: Capacitor - 33pF [0402] (Ceramic))
D7  Case: 0402  Color: Red  [LED_0402]  (hidden comment: SMD LED (Red))
FB1  Maximum DC Current: 2A  Case: 0603  Manufacturer Part Number: BLM18EG101TZ1D  Manufacturer Name: Murata Electronics  [INDUCTOR_0603]  (hidden comment: Ferrite Bead)
FB2  Maximum DC Current: 2A  Case: 0603  Manufacturer Part Number: BLM18EG101TZ1D  Manufacturer Name: Murata Electronics  [INDUCTOR_0603]  (hidden comment: Ferrite Bead)
L3  value 2.2 uH  Manufacturer Name: Murata  Protection: Shielded  [LQH3NPN2R2MMEL]  (hidden comment: LQH3NPN2R2MMEL)
Q2  Manufacturer Name: Nexperia  Polarity: NPN  [SOT1215]  (hidden comment: BC847AQAZ)
R12  value 330R  Case: 0402  Tolerance: %1  Power: 1/16W  [RESISTOR_0402]  (hidden comment: 330R - 0402 - %1 - 1/16W)
R13  value 100K  Tolerance: %1  Case: 0402  Power: 1/16W  [RESISTOR_0402]  (hidden comment: 100K - 0402 - %1 - 1/16W)
R14  value 383K  Tolerance: %1  Case: 0402  Power: 1/16W  [RESISTOR_0402]  (hidden comment: 383K - 0402 - %1 - 1/16W)
R15  value 47K  Tolerance: %1  Case: 0402  Power: 1/16W  [RESISTOR_0402]  (hidden comment: 47K - 0402 - %1 - 1/16W)
R20  value 100K  Tolerance: %1  Case: 0402  Power: 1/16W  [RESISTOR_0402]  (hidden comment: 100K - 0402 - %1 - 1/16W)
TP10  VCC  [TP]  (no BOM)
TP11  3V8  [TP]  (no BOM)
TP12  Power_EN  [TP]  (no BOM)
U1  Manufacturer Part Number: LE910C1-EUX  Manufacturer Name: Telit  [LE910 GSM Modem]  (hidden comment: LE910C1-EUX LTE GSM Module)  (part A of 19)
U3  Manufacturer Name: Texas Instruments  Output Current: 3A  Input Voltage - Max: 17V  Quiescent Current: 17uA  [VQFN-EP-16]  (hidden comment: TPS62130ARGTR)

### Ports
3V3_POWER_EN (in)

### Nets
3V3: D7.2
3V8: C32.1 C33.2 C38.2 FB1.1 FB2.1 L3.2 R13.2 R14.2 TP11.1 U3.14(VOS)
GND: C22.1 C23.1 C24.1 C25.1 C27.1 C28.1 C29.1 C30.1 C31.1 C32.2 C33.1 C34.1 C35.1 C38.1 Q2.2(E) R15.1 R20.1 U1.A02(GND) U1.B13(GND) U1.D04(GND) U1.E01(GND) U1.E02(GND) U1.E14(GND) U1.F02(GND) U1.G01(GND) U1.G02(GND) U1.G07(GND) U1.G08(GND) U1.G09(GND) U1.H01(GND) U1.H02(GND) U1.H07(GND) U1.H08(GND) U1.H09(GND) U1.J01(GND) U1.J02(GND) U1.J07(GND) U1.J08(GND) U1.J09(GND) U1.K02(GND) U1.L01(GND) U1.L02(GND) U1.M03(GND) U1.M04(GND) U1.M12(GND) U1.N03(GND) U1.N04(GND) U1.N05(GND) U1.N06(GND) U1.P03(GND) U1.P04(GND) U1.P05(GND) U1.P06(GND) U1.P08(GND) U1.P09(GND) U1.P10(GND) U1.P13(GND) U1.R02(GND) U1.R03(GND) U1.R05(GND) U1.R06(GND) U1.R08(GND) U1.R10(GND) U3.6(AGND) U3.7(FSW) U3.8(DEF) U3.15(PGND) U3.16(PGND) U3.17(EP)
VCC: C27.2 C28.2 C29.2 TP10.1 U3.10(AVIN) U3.11(PVIN) U3.12(PVIN)
3V3_POWER_EN: C30.2 R15.2 TP12.1 U3.13(EN) ; port 3V3_POWER_EN
3V8_Sense: R14.1 R20.2 U3.5(FB)
PG: C22.2 Q2.1(B) R13.1 U3.4(PG)
Power_Enable_LED: C23.2 D7.1 R12.2
SW: L3.1 U3.1(SW) U3.2(SW) U3.3(SW)
VBATT: C24.2 C25.2 FB1.2 U1.M01(VBATT) U1.M02(VBATT)
VBATT_PA: C34.2 C35.2 FB2.2 U1.N01(VBATT_PA) U1.N02(VBATT_PA) U1.P01(VBATT_PA) U1.P02(VBATT_PA)
NetC31_2: C31.2 U3.9(SS/TR)
NetQ2_3: Q2.3(C) R12.1

Not connected (* = marked no-connect by the designer): U1 E13(VIO_1V8)*

### Layout directives
rule Supply Nets [Voltage = 3.800]: 3V8, VBATT, VBATT_PA

### Notes on the sheet
- Max 17V
- VCC
- 3V8
- 3000 mA
- (near R14) R2
- 3V3
  Active HIGH
- (near R20) Leak Current = 8 µA
- 130 uA
- (near R20) R1
- Capacitors must be placed close to modem pad.
- Tantalium Capacitor
- LED activates when GSM modem enabled.
- TPS62130 FB Divider Calculation (VFB = 0.800 V typ)
  RTOP = 383 kΩ
  RBOT = 100 kΩ
  VOUT = VFB * (1 + RTOP/RBOT)
  VOUT = 0.800 * (1 + 383k/100k)
  = 0.800 * (1 + 3.83)
  = 0.800 * 4.83
  = 3.864 V  (typ)
  Divider current:
  IDIV ≈ VOUT / (RTOP + RBOT)
  = 3.864 V / 483 kΩ
  ≈ 8.00 µA
- 1.21 mA
- (near C23) Noise filter capacitors. Place as close as possible to LED.
- © 2026 All rights reserved.
  This document may not, in whole or in part, be copied, photocopied, reproduced, translated or converted to any electronic or machine readable from without prior written permission of Mehmet Günce Akkoyun.
  Engineer contact : akkoyun@me.com
- Property of
- Engineer :
- Date :
- Size :
- A4
- Time :
- Project :
- Page :
- /
- Customer :
- Product ID :
- Module ID :
- Version :
- File :
- Revision :
- (in symbol IC - LE910C1-EUX, part A) Power Supply
- (in symbol IC - TPS62130) Output Current :; Max Input Voltage :; Quiescent Current :

### Library data of the parts
C22 C23 C25 C30 C35 C38 = Capacitor - 33pF [0402-6V3]: as C11 on sheet Voltage_Translator; ComponentLink1Description: DataSheet; ComponentLink1URL: https://api.kemet.com/component-edge/download/datasheet/C0402C330J9RACAUTO.pdf; ComponentLink2Description: Mouser; ComponentLink2URL: https://www.mouser.com/Search/Refine.aspx?Keyword=80-C0402C330J9RAUTO
C24 = Capacitor - 47uF [1206-10V]: Multilayer Ceramic Capacitors MLCC - SMD/SMT 47UF 10V 20% 1206; Manufacturer Part Number: C1206C476M8PAC; Manufacturer Name: Kemet
C27 = Capacitor - 1uF [0603-25V]: Multilayer Ceramic Capacitors - SMD - 25V 1uF X7R 0603 10%; Manufacturer Part Number: GCJ188R71E105KA01D; Manufacturer Name: Murata
C28 C29 = Capacitor - 22uF [0603-6V3]: Capacitor (MLCC) - 22uF / 6V3 / 0603; Manufacturer Part Number: GRM188R60J226MEA0D; Manufacturer Name: Murata Electronics; Subcategory: Capacitors; ComponentLink1Description: DataSheet; ComponentLink1URL: https://www.mouser.com.tr/datasheet/2/281/1/GRM188R60J226MEA0_01A-1985763.pdf; ComponentLink2Description: Mouser; ComponentLink2URL: https://www.mouser.com.tr/ProductDetail/Murata-Electronics/GRM188R60J226MEA0D?qs=p%2FZgMVRdWRkAKoLX3oNjgw%3D%3D
C31 = Capacitor - 4.7nF [0402-6V3]: Capacitor (MLCC) - 4.7nF / 6V3 / 0402; Manufacturer Name: KEMET; Manufacturer Part Number: C0402C472K9RACTU; Subcategory: Capacitors; ComponentLink1Description: DataSheet; ComponentLink1URL: https://www.mouser.com.tr/datasheet/2/447/KEM_C1002_X7R_SMD-3316098.pdf; ComponentLink2Description: Mouser; ComponentLink2URL: https://www.mouser.com.tr/ProductDetail/KEMET/C0402C472K9RACTU?qs=9uNKmdvpmtsLrzteMCrAvw%3D%3D
C32 = Capacitor - 68uF [1206-6V3]: Capacitor (Tantalum) - 68uF / 6V3 / 1206; Manufacturer Name: Kemet; Manufacturer Part Number: T491A686K006AT; ComponentLink1Description: DataSheet; ComponentLink1URL: https://www.mouser.com.tr/datasheet/2/315/AAA8000C36-944332.pdf; Subcategory: Capacitors; ComponentLink2Description: Mouser; ComponentLink2URL: https://www.mouser.com.tr/ProductDetail/Panasonic/10TPE68M?qs=OE1iw1LrrPG6aGLnsZkr4w%3D%3D
C33 = Capacitor - 100nF [0402-6V3]: as C9 on sheet Voltage_Translator; ComponentLink1Description: Mouser; ComponentLink1URL: https://www.mouser.com.tr/ProductDetail/AVX/04026D104KAT4A?qs=sGAEpiMZZMs0AnBnWHyRQPg4iYkCw7IMED%2F4kpqgf7w%3D; ComponentLink2Description: DataSheet; ComponentLink2URL: https://www.mouser.com.tr/datasheet/2/40/cx5r-776519.pdf
C34 = Capacitor - 100uF [1206-10V]: Multilayer Ceramic Capacitors MLCC - SMD/SMT 100UF 10V 20% 1206; Manufacturer Part Number: GRM31CR61A107MEA8L; Manufacturer Name: Murata
D7 = Diode - LED (0402-Red): Standard LEDs - SMD MINI-MOLD ULTRA COMPACT RED; Manufacturer Name: ROHM Semiconductor; Manufacturer Part Number: SML-P12VTT86R; ROHS: Yes; ComponentLink1Description: DataSheet; ComponentLink1URL: https://www.mouser.com.tr/datasheet/2/348/sml-p1-e-1139198.pdf; ComponentLink2Description: Mouser; ComponentLink2URL: https://www.mouser.com.tr/ProductDetail/ROHM-Semiconductor/SML-P12U2TT86R?qs=sGAEpiMZZMseGfSY3csMkRIBDsfU3UCXJTULB5gem9Ta%252Bp%252BvZ709fg%3D%3D
FB1 FB2 = Inductor - Ferrite Bead [SMD]: Ferrite Beads 0603 100ohms 2000mA Auto Infotainment; Maximum DC Resistance: 45 mOhms; Tolerance: 25%; Value: BLM18EG101TZ1D; Height: 0.75mm; Maximum Operating Temperature: + 125; Minimum Operating Temperature: -55
L3 = Inductor - LQH3NPN2R2MMEL: 1.52 A. Power Inductors - SMD 4.7 UH 20%; Case: SMD; Manufacturer Part Number: LQH3NPN2R2MMEL
Q2 = Transistor - BC847: Bipolar NPN Transistors; Case: DFN-1010D-3; Manufacturer Part Number: BC847AQAZ
R12 = Resistor - 330R [0402]: as R1 on sheet Stat_LED_Driver; ComponentLink1Description: DataSheet; ComponentLink1URL: https://www.mouser.com.tr/datasheet/2/427/dcrcwe3-1762152.pdf; ComponentLink2Description: Mouser; ComponentLink2URL: https://www.mouser.com.tr/ProductDetail/Vishay-Dale/CRCW0402330RFKED?qs=sGAEpiMZZMu61qfTUdNhG2DpbjADlD3GGS6SwBlLi5Q%3D
R13 R20 = Resistor - 100K [0402]: Thick Film Resistors - SMD 1/16 W 100 KOhm 1%; Manufacturer Name: Vishay; Manufacturer Part Number: CRCW0402100KFKED; ComponentLink1Description: DataSheet; ComponentLink1URL: https://www.mouser.com.tr/datasheet/2/427/dcrcwe3-1762152.pdf; ComponentLink2Description: Mouser; ComponentLink2URL: https://www.mouser.com.tr/ProductDetail/Vishay-Dale/CRCW040210K0FKED?qs=sGAEpiMZZMu61qfTUdNhG2DpbjADlD3GcalbOv9utCY%3D
R14 = Resistor - 383K [0402]: Thick Film Resistors - SMD 1/16 W 383 KOhm 1%; Manufacturer Name: Vishay; Manufacturer Part Number: CRCW0402383KFKED
R15 = Resistor - 47K [0402]: as R5 on sheet Voltage_Translator; ComponentLink1Description: DataSheet; ComponentLink1URL: https://www.mouser.com.tr/datasheet/2/427/dcrcwe3-1762152.pdf; ComponentLink2Description: Mouser; ComponentLink2URL: https://www.mouser.com.tr/ProductDetail/Vishay-Dale/CRCW040247K0FKED?qs=sGAEpiMZZMu61qfTUdNhG2DpbjADlD3GL%252B3h1elTxqU%3D
TP10-TP12 = PCB - Test Point: Test Point
U1 = IC - LE910C1-EUX: Telit LE910C1-EUX LTE/2G GSM Module; Case: BGA
U3 = IC - TPS62130: Switching Voltage Regulators 3-17V 3A Step Down Converter.; Case: VQFN-EP-16; Manufacturer Part Number: TPS62130ARGTR

## Sheet Unused_Modem_Pins.SchDoc: Unused Modem Pins
size 292 x 193 mm; SheetNumber: 9; SheetTotal: 9
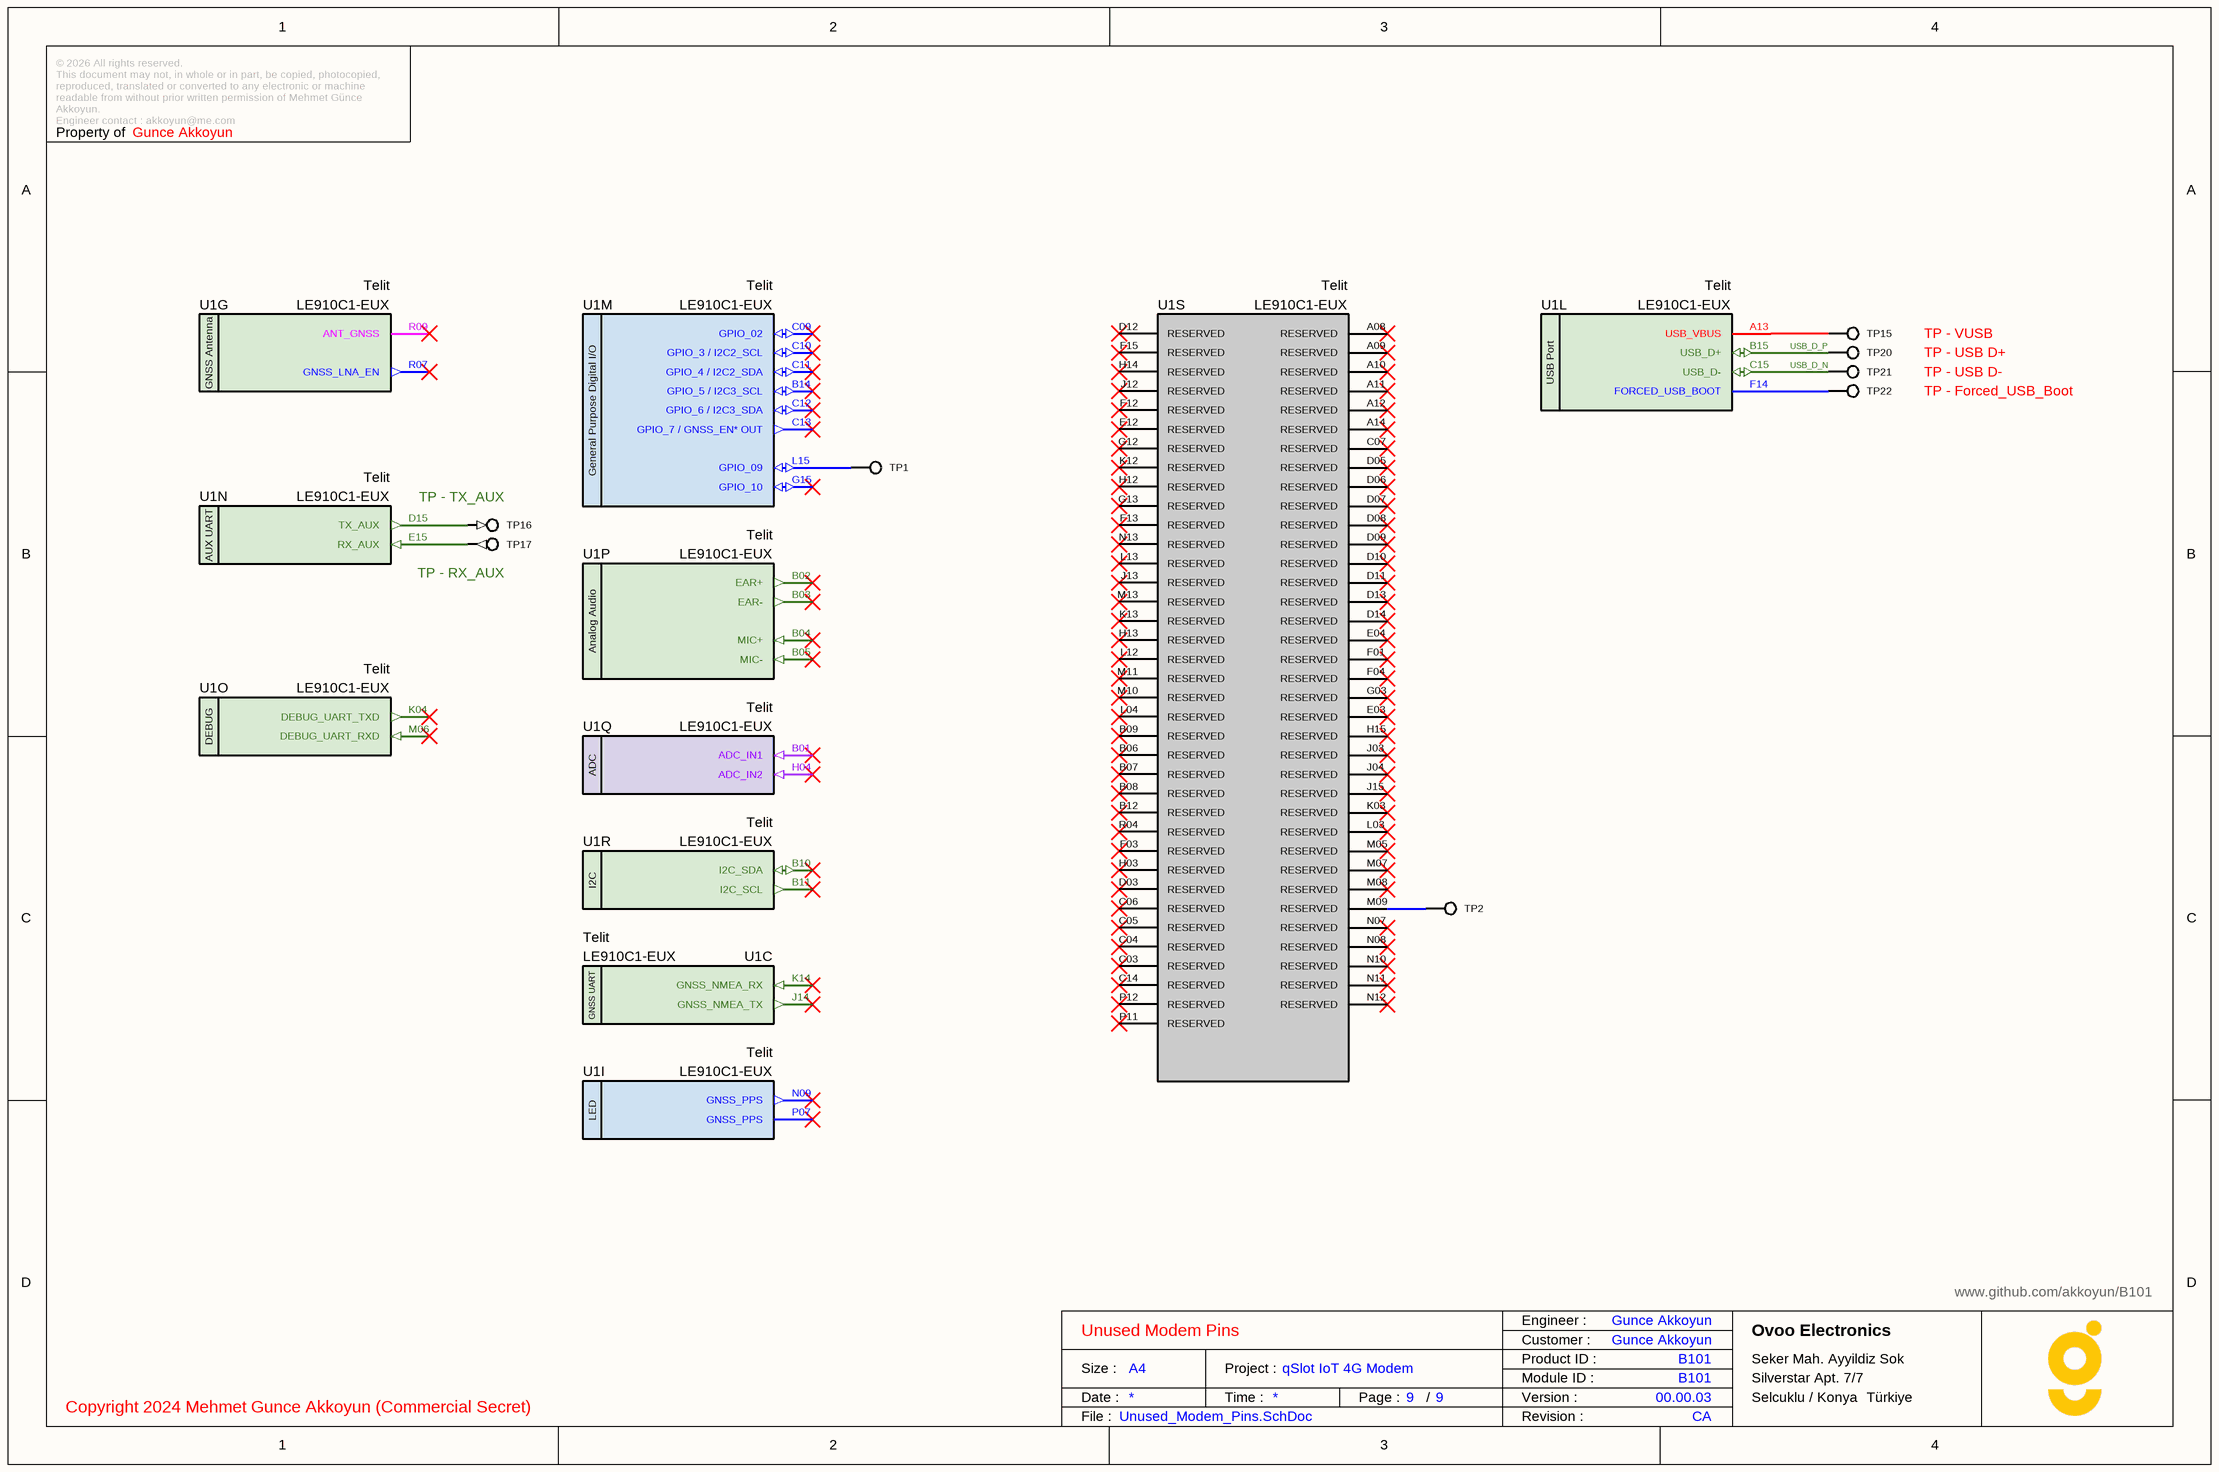
[diagram p7: Unused_Modem_Pins.SchDoc]

### Parts
TP1  PCB - Test Point  [TP]  (value not drawn)  (no BOM)
TP2  PCB - Test Point  [TP]  (value not drawn)  (no BOM)
TP15  TP - VUSB  [TP]  (no BOM)
TP16  TP - TX_AUX  [TP]  (no BOM)
TP17  TP - RX_AUX  [TP]  (no BOM)
TP20  TP - USB D+  [TP]  (no BOM)
TP21  TP - USB D-  [TP]  (no BOM)
TP22  TP - Forced_USB_Boot  [TP]  (no BOM)
U1  Manufacturer Part Number: LE910C1-EUX  Manufacturer Name: Telit  [LE910 GSM Modem]  (hidden comment: LE910C1-EUX LTE GSM Module)  (parts C,G,I,L,M,N,O,P,Q,R,S of 19)

### Nets
USB_D_N: TP21.1 U1.C15(USB_D-)
USB_D_P: TP20.1 U1.B15(USB_D+)
NetTP1_1: TP1.1 U1.L15(GPIO_09)
NetTP2_1: TP2.1 U1.M09(RESERVED)
NetTP15_1: TP15.1 U1.A13(USB_VBUS)
NetTP16_1: TP16.1 U1.D15(TX_AUX)
NetTP17_1: TP17.1 U1.E15(RX_AUX)
NetTP22_1: TP22.1 U1.F14(FORCED_USB_BOOT)

Not connected (* = marked no-connect by the designer): U1 A08(RESERVED)* A09(RESERVED)* A10(RESERVED)* A11(RESERVED)* A12(RESERVED)* A14(RESERVED)* B01(ADC_IN1)* B02(EAR+)* B03(EAR-)* B04(MIC+)* B05(MIC-)* B06(RESERVED)* B07(RESERVED)* B08(RESERVED)* B09(RESERVED)* B10(I2C_SDA)* B11(I2C_SCL)* B12(RESERVED)* B14(GPIO_5_/_I2C3_SCL)* C03(RESERVED)* C04(RESERVED)* C05(RESERVED)* C06(RESERVED)* C07(RESERVED)* C09(GPIO_02)* C10(GPIO_3_/_I2C2_SCL)* C11(GPIO_4_/_I2C2_SDA)* C12(GPIO_6_/_I2C3_SDA)* C13(GPIO_7_/_GNSS_EN*_OUT)* C14(RESERVED)* D03(RESERVED)* D05(RESERVED)* D06(RESERVED)* D07(RESERVED)* D08(RESERVED)* D09(RESERVED)* D10(RESERVED)* D11(RESERVED)* D12(RESERVED)* D13(RESERVED)* D14(RESERVED)* E03(RESERVED)* E04(RESERVED)* E12(RESERVED)* F01(RESERVED)* F03(RESERVED)* F04(RESERVED)* F12(RESERVED)* F13(RESERVED)* F15(RESERVED)* G03(RESERVED)* G12(RESERVED)* G13(RESERVED)* G15(GPIO_10)* H03(RESERVED)* H04(ADC_IN2)* H12(RESERVED)* H13(RESERVED)* H14(RESERVED)* H15(RESERVED)* J03(RESERVED)* J04(RESERVED)* J12(RESERVED)* J13(RESERVED)* J14(GNSS_NMEA_TX)* J15(RESERVED)* K03(RESERVED)* K04(DEBUG_UART_TXD)* K12(RESERVED)* K13(RESERVED)* K14(GNSS_NMEA_RX)* L03(RESERVED)* L04(RESERVED)* L12(RESERVED)* L13(RESERVED)* M05(RESERVED)* M06(DEBUG_UART_RXD)* M07(RESERVED)* M08(RESERVED)* M10(RESERVED)* M11(RESERVED)* M13(RESERVED)* N07(RESERVED)* N08(RESERVED)* N09(GNSS_PPS)* N10(RESERVED)* N11(RESERVED)* N12(RESERVED)* N13(RESERVED)* P07(GNSS_PPS)* P11(RESERVED)* P12(RESERVED)* R04(RESERVED)* R07(GNSS_LNA_EN)* R09(ANT_GNSS)*

### Notes on the sheet
- © 2026 All rights reserved.
  This document may not, in whole or in part, be copied, photocopied, reproduced, translated or converted to any electronic or machine readable from without prior written permission of Mehmet Günce Akkoyun.
  Engineer contact : akkoyun@me.com
- Property of
- Engineer :
- Date :
- Size :
- A4
- Time :
- Project :
- Page :
- /
- Customer :
- Product ID :
- Module ID :
- Version :
- File :
- Revision :
- (in symbol IC - LE910C1-EUX, part C) GNSS UART
- (in symbol IC - LE910C1-EUX, part G) GNSS Antenna
- (in symbol IC - LE910C1-EUX, part I) LED
- (in symbol IC - LE910C1-EUX, part L) USB Port
- (in symbol IC - LE910C1-EUX, part M) General Purpose Digital I/O
- (in symbol IC - LE910C1-EUX, part N) AUX UART
- (in symbol IC - LE910C1-EUX, part O) DEBUG
- (in symbol IC - LE910C1-EUX, part P) Analog Audio
- (in symbol IC - LE910C1-EUX, part Q) ADC
- (in symbol IC - LE910C1-EUX, part R) I2C

### Library data of the parts
TP1 TP2 TP15-TP17 TP20-TP22 = PCB - Test Point: Test Point
U1 = IC - LE910C1-EUX: Telit LE910C1-EUX LTE/2G GSM Module; Case: BGA

## Sheet Edge_Connector.SchDoc: Card Edge Connector
size 292 x 193 mm; SheetNumber: 2; SheetTotal: 9
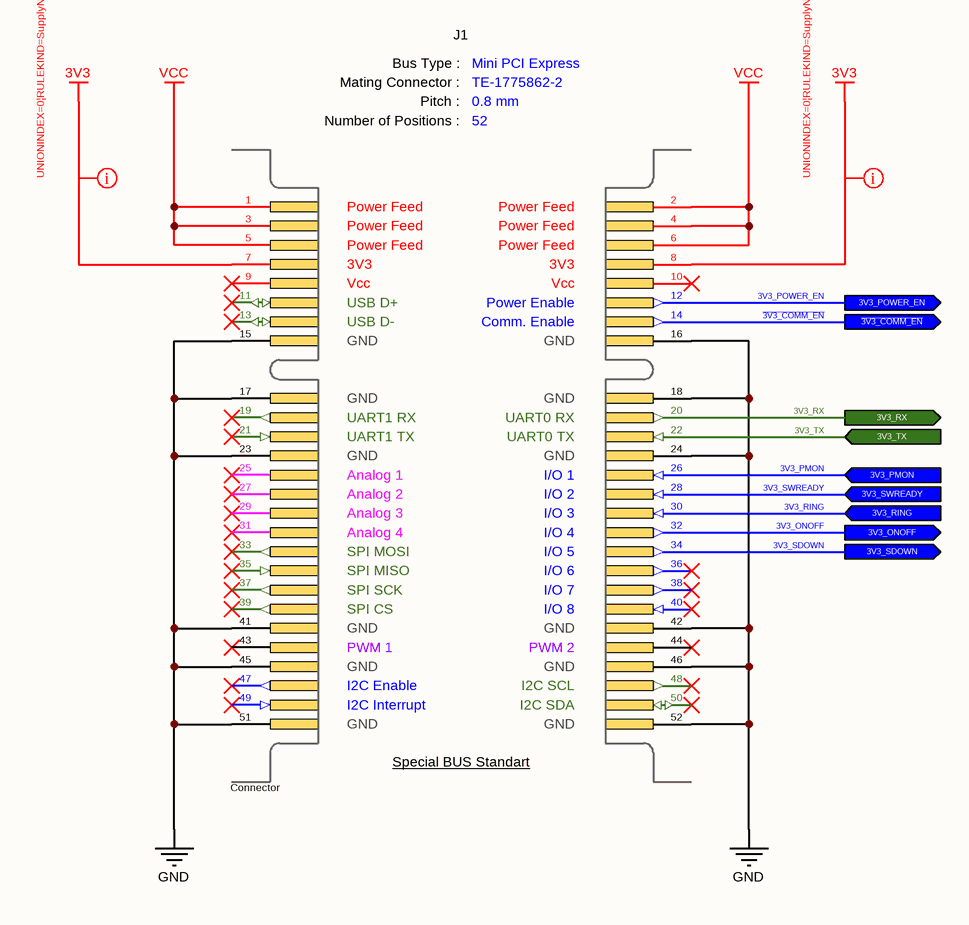
[diagram p8: Edge_Connector.SchDoc]

### Parts
J1  BUS Type: Mini PCI Express  Mating Connector: TE-1775862-2  Pitch: 0.8 mm  Number of Positions: 52  System: Connector  [PCB - Mini PCI Express]  (hidden comment: Connector - Mini PCI-E [Add-on])  (no BOM)

### Ports
3V3_ONOFF (out), 3V3_PMON (in), 3V3_POWER_EN (out), 3V3_RING (in), 3V3_RX (out), 3V3_SDOWN (out), 3V3_SWREADY (in), 3V3_TX (in), ~{3V3_COMM_EN} (out)

### Nets
3V3: J1.7(Pin-7) J1.8(Pin-8)
GND: J1.15(Pin-15) J1.16(Pin-16) J1.17(Pin-17) J1.18(Pin-18) J1.23(Pin-23) J1.24(Pin-24) J1.41(Pin-41) J1.42(Pin-42) J1.45(Pin-45) J1.46(Pin-46) J1.51(Pin-51) J1.52(Pin-52)
VCC: J1.1(Pin-1) J1.2(Pin-2) J1.3(Pin-3) J1.4(Pin-4) J1.5(Pin-5) J1.6(Pin-6)
~{3V3_COMM_EN}: J1.14(Pin-14) ; port ~{3V3_COMM_EN}
3V3_ONOFF: J1.32(Pin-32) ; port 3V3_ONOFF
3V3_PMON: J1.26(Pin-26) ; port 3V3_PMON
3V3_POWER_EN: J1.12(Pin-12) ; port 3V3_POWER_EN
3V3_RING: J1.30(Pin-30) ; port 3V3_RING
3V3_RX: J1.20(Pin-20) ; port 3V3_RX
3V3_SDOWN: J1.34(Pin-34) ; port 3V3_SDOWN
3V3_SWREADY: J1.28(Pin-28) ; port 3V3_SWREADY
3V3_TX: J1.22(Pin-22) ; port 3V3_TX

Not connected (* = marked no-connect by the designer): J1 9(Pin-9)* 10(Pin-10)* 11(Pin-11)* 13(Pin-13)* 19(Pin-19)* 21(Pin-21)* 25(Pin-25)* 27(Pin-27)* 29(Pin-29)* 31(Pin-31)* 33(Pin-33)* 35(Pin-35)* 36(Pin-36)* 37(Pin-37)* 38(Pin-38)* 39(Pin-39)* 40(Pin-40)* 43(Pin-43)* 44(Pin-44)* 47(Pin-47)* 48(Pin-48)* 49(Pin-49)* 50(Pin-50)*

### Layout directives
rule Supply Nets [Voltage = 3.300]: 3V3

### Notes on the sheet
- © 2026 All rights reserved.
  This document may not, in whole or in part, be copied, photocopied, reproduced, translated or converted to any electronic or machine readable from without prior written permission of Mehmet Günce Akkoyun.
  Engineer contact : akkoyun@me.com
- Property of
- Engineer :
- Date :
- Size :
- A4
- Time :
- Project :
- Page :
- /
- Customer :
- Product ID :
- Module ID :
- Version :
- File :
- Revision :
- (in symbol Connector - Mini PCI-E [Add-on]) Bus Type :; Mating Connector :; Pitch :; Number of Positions :; Power Feed; 3V3; Vcc; USB D+; Power Enable; USB D-; Comm. Enable; GND; UART1 RX; UART0 RX; UART1 TX; UART0 TX; Analog 1; I/O 1; Analog 2; I/O 2; Analog 3; I/O 3; Analog 4; I/O 4; SPI MOSI; I/O 5; SPI MISO; I/O 6; SPI SCK; I/O 7; SPI CS; I/O 8; PWM 1; PWM 2; I2C Enable; I2C SCL; I2C Interrupt; I2C SDA; Special BUS Standart

### Library data of the parts
J1 = Connector - Mini PCI-E [Add-on]: Mini PCI-Express gold finger connector.

## Sheet Control_Signals.SchDoc: Control Signals
size 292 x 193 mm; SheetNumber: 5; SheetTotal: 9
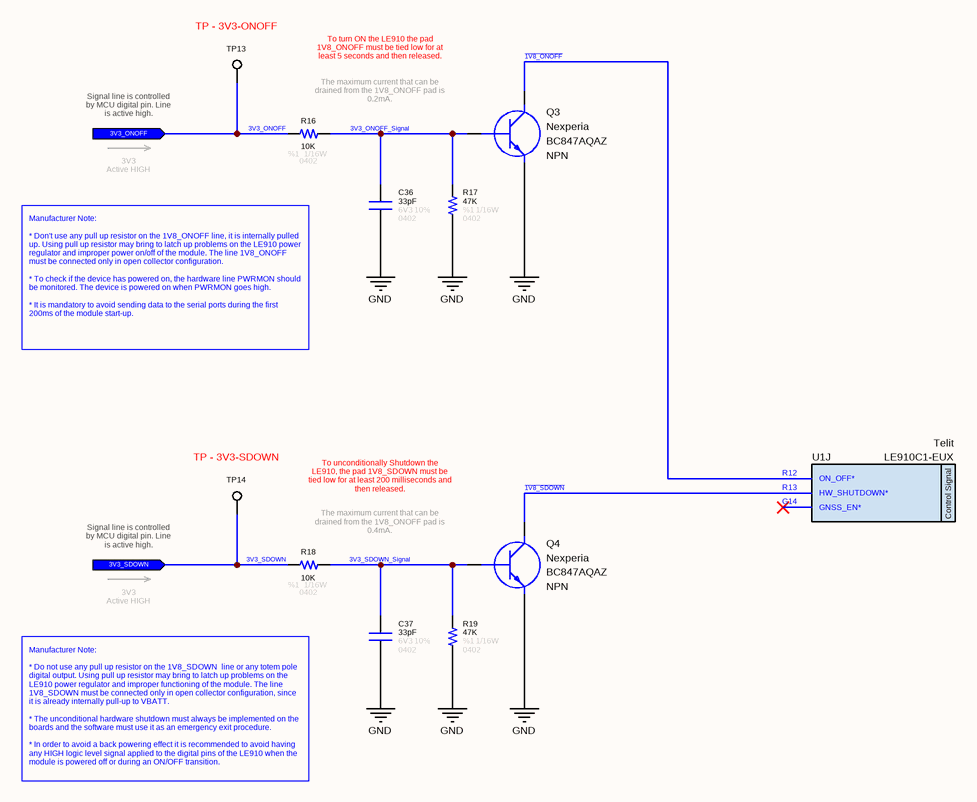
[diagram p9: Control_Signals.SchDoc]

### Parts
C36  value 33pF  Tolerance: 10%  Case: 0402  Voltage: 6V3  [CAPACITOR_0402]  (hidden comment: Capacitor - 33pF [0402] (Ceramic))
C37  value 33pF  Tolerance: 10%  Case: 0402  Voltage: 6V3  [CAPACITOR_0402]  (hidden comment: Capacitor - 33pF [0402] (Ceramic))
Q3  Manufacturer Name: Nexperia  Polarity: NPN  [SOT1215]  (hidden comment: BC847AQAZ)
Q4  Manufacturer Name: Nexperia  Polarity: NPN  [SOT1215]  (hidden comment: BC847AQAZ)
R16  value 10K  Tolerance: %1  Case: 0402  Power: 1/16W  [RESISTOR_0402]  (hidden comment: 10K - 0402 - %1 - 1/16W)
R17  value 47K  Tolerance: %1  Case: 0402  Power: 1/16W  [RESISTOR_0402]  (hidden comment: 47K - 0402 - %1 - 1/16W)
R18  value 10K  Tolerance: %1  Case: 0402  Power: 1/16W  [RESISTOR_0402]  (hidden comment: 10K - 0402 - %1 - 1/16W)
R19  value 47K  Tolerance: %1  Case: 0402  Power: 1/16W  [RESISTOR_0402]  (hidden comment: 47K - 0402 - %1 - 1/16W)
TP13  TP - 3V3-ONOFF  [TP]  (no BOM)
TP14  TP - 3V3-SDOWN  [TP]  (no BOM)
U1  Manufacturer Part Number: LE910C1-EUX  Manufacturer Name: Telit  [LE910 GSM Modem]  (hidden comment: LE910C1-EUX LTE GSM Module)  (part J of 19)

### Ports
3V3_ONOFF (in), 3V3_SDOWN (in)

### Nets
GND: C36.1 C37.1 Q3.2(E) Q4.2(E) R17.1 R19.1
~{1V8_ONOFF}: Q3.3(C) U1.R12(ON_OFF*)
~{1V8_SDOWN}: Q4.3(C) U1.R13(HW_SHUTDOWN*)
3V3_ONOFF: R16.2 TP13.1 ; port 3V3_ONOFF
3V3_ONOFF_Signal: C36.2 Q3.1(B) R16.1 R17.2
3V3_SDOWN: R18.2 TP14.1 ; port 3V3_SDOWN
3V3_SDOWN_Signal: C37.2 Q4.1(B) R18.1 R19.2

Not connected (* = marked no-connect by the designer): U1 G14(GNSS_EN*)*

### Notes on the sheet
- To turn ON the LE910 the pad 1V8_ONOFF must be tied low for at least 5 seconds and then released.
- Signal line is controlled by MCU digital pin. Line is active high.
- The maximum current that can be drained from the 1V8_ONOFF pad is 0.2mA.
- 3V3
  Active HIGH
- Manufacturer Note:
  * Don't use any pull up resistor on the 1V8_ONOFF line, it is internally pulled up. Using pull up resistor may bring to latch up problems on the LE910 power regulator and improper power on/off of the module. The line 1V8_ONOFF must be connected only in open collector configuration.
  * To check if the device has powered on, the hardware line PWRMON should be monitored. The device is powered on when PWRMON goes high.
  * It is mandatory to avoid sending data to the serial ports during the first 200ms of the module start-up.
- To unconditionally Shutdown the LE910, the pad 1V8_SDOWN must be tied low for at least 200 milliseconds and then released.
- The maximum current that can be drained from the 1V8_ONOFF pad is 0.4mA.
- Manufacturer Note:
  * Do not use any pull up resistor on the 1V8_SDOWN  line or any totem pole digital output. Using pull up resistor may bring to latch up problems on the LE910 power regulator and improper functioning of the module. The line 1V8_SDOWN must be connected only in open collector configuration, since it is already internally pull-up to VBATT.
  * The unconditional hardware shutdown must always be implemented on the boards and the software must use it as an emergency exit procedure.
  * In order to avoid a back powering effect it is recommended to avoid having any HIGH logic level signal applied to the digital pins of the LE910 when the module is powered off or during an ON/OFF transition.
- © 2026 All rights reserved.
  This document may not, in whole or in part, be copied, photocopied, reproduced, translated or converted to any electronic or machine readable from without prior written permission of Mehmet Günce Akkoyun.
  Engineer contact : akkoyun@me.com
- Property of
- Engineer :
- Date :
- Size :
- A4
- Time :
- Project :
- Page :
- /
- Customer :
- Product ID :
- Module ID :
- Version :
- File :
- Revision :
- (in symbol IC - LE910C1-EUX, part J) Control Signal

### Library data of the parts
C36 C37 = Capacitor - 33pF [0402-6V3]: as C11 on sheet Voltage_Translator; ComponentLink1Description: DataSheet; ComponentLink1URL: https://api.kemet.com/component-edge/download/datasheet/C0402C330J9RACAUTO.pdf; ComponentLink2Description: Mouser; ComponentLink2URL: https://www.mouser.com/Search/Refine.aspx?Keyword=80-C0402C330J9RAUTO
Q3 Q4 = Transistor - BC847: Bipolar NPN Transistors; Case: DFN-1010D-3; Manufacturer Part Number: BC847AQAZ
R16 R18 = Resistor - 10K [0402]: Thick Film Resistors - SMD 1/16 W 10 KOhm 1%; Manufacturer Name: Vishay; Manufacturer Part Number: CRCW040210K0FKED; ComponentLink1Description: DataSheet; ComponentLink1URL: https://www.mouser.com.tr/datasheet/2/427/dcrcwe3-1762152.pdf; ComponentLink2Description: Mouser; ComponentLink2URL: https://www.mouser.com.tr/ProductDetail/Vishay-Dale/CRCW040210K0FKED?qs=sGAEpiMZZMu61qfTUdNhG2DpbjADlD3GcalbOv9utCY%3D
R17 R19 = Resistor - 47K [0402]: as R5 on sheet Voltage_Translator; ComponentLink1Description: DataSheet; ComponentLink1URL: https://www.mouser.com.tr/datasheet/2/427/dcrcwe3-1762152.pdf; ComponentLink2Description: Mouser; ComponentLink2URL: https://www.mouser.com.tr/ProductDetail/Vishay-Dale/CRCW040247K0FKED?qs=sGAEpiMZZMu61qfTUdNhG2DpbjADlD3GL%252B3h1elTxqU%3D
TP13 TP14 = PCB - Test Point: Test Point
U1 = IC - LE910C1-EUX: Telit LE910C1-EUX LTE/2G GSM Module; Case: BGA

## Nets that join several sheets
3V3: Voltage_Translator (C9.2 R5.2 R6.2 U2.1), Stat_LED_Driver (D6.2), 3V8_Power_Regulator (D7.2), Edge_Connector (J1.7 J1.8)
GND: Voltage_Translator (19 pins), Antenna (7 pins), Stat_LED_Driver (C6.1 Q1.2 R3.1), SIM_Socket (17 pins), 3V8_Power_Regulator (69 pins), Edge_Connector (12 pins), Control_Signals (6 pins)
VCC: 3V8_Power_Regulator (7 pins), Edge_Connector (6 pins)
~{3V3_COMM_EN}: Voltage_Translator (C16.2 R5.1 TP9.1 U2.22), Edge_Connector (J1.14)
3V3_ONOFF: Edge_Connector (J1.32), Control_Signals (R16.2 TP13.1)
3V3_PMON: Voltage_Translator (C11.2 R7.2 TP6.1 U2.3), Edge_Connector (J1.26)
3V3_POWER_EN: 3V8_Power_Regulator (C30.2 R15.2 TP12.1 U3.13), Edge_Connector (J1.12)
3V3_RING: Voltage_Translator (C13.2 R9.2 TP8.1 U2.5), Edge_Connector (J1.30)
3V3_RX: Voltage_Translator (C15.2 TP5.1 U2.9), Edge_Connector (J1.20)
3V3_SDOWN: Edge_Connector (J1.34), Control_Signals (R18.2 TP14.1)
3V3_SWREADY: Voltage_Translator (C12.2 R8.2 TP7.1 U2.4), Edge_Connector (J1.28)
3V3_TX: Voltage_Translator (C14.2 TP4.1 U2.6), Edge_Connector (J1.22)

## Assembly variants
Production: not fitted C2 C3 C4 C5 C7 C8 L1 L2